# EAGLE design InkTime (EAGLE 9.7.0)
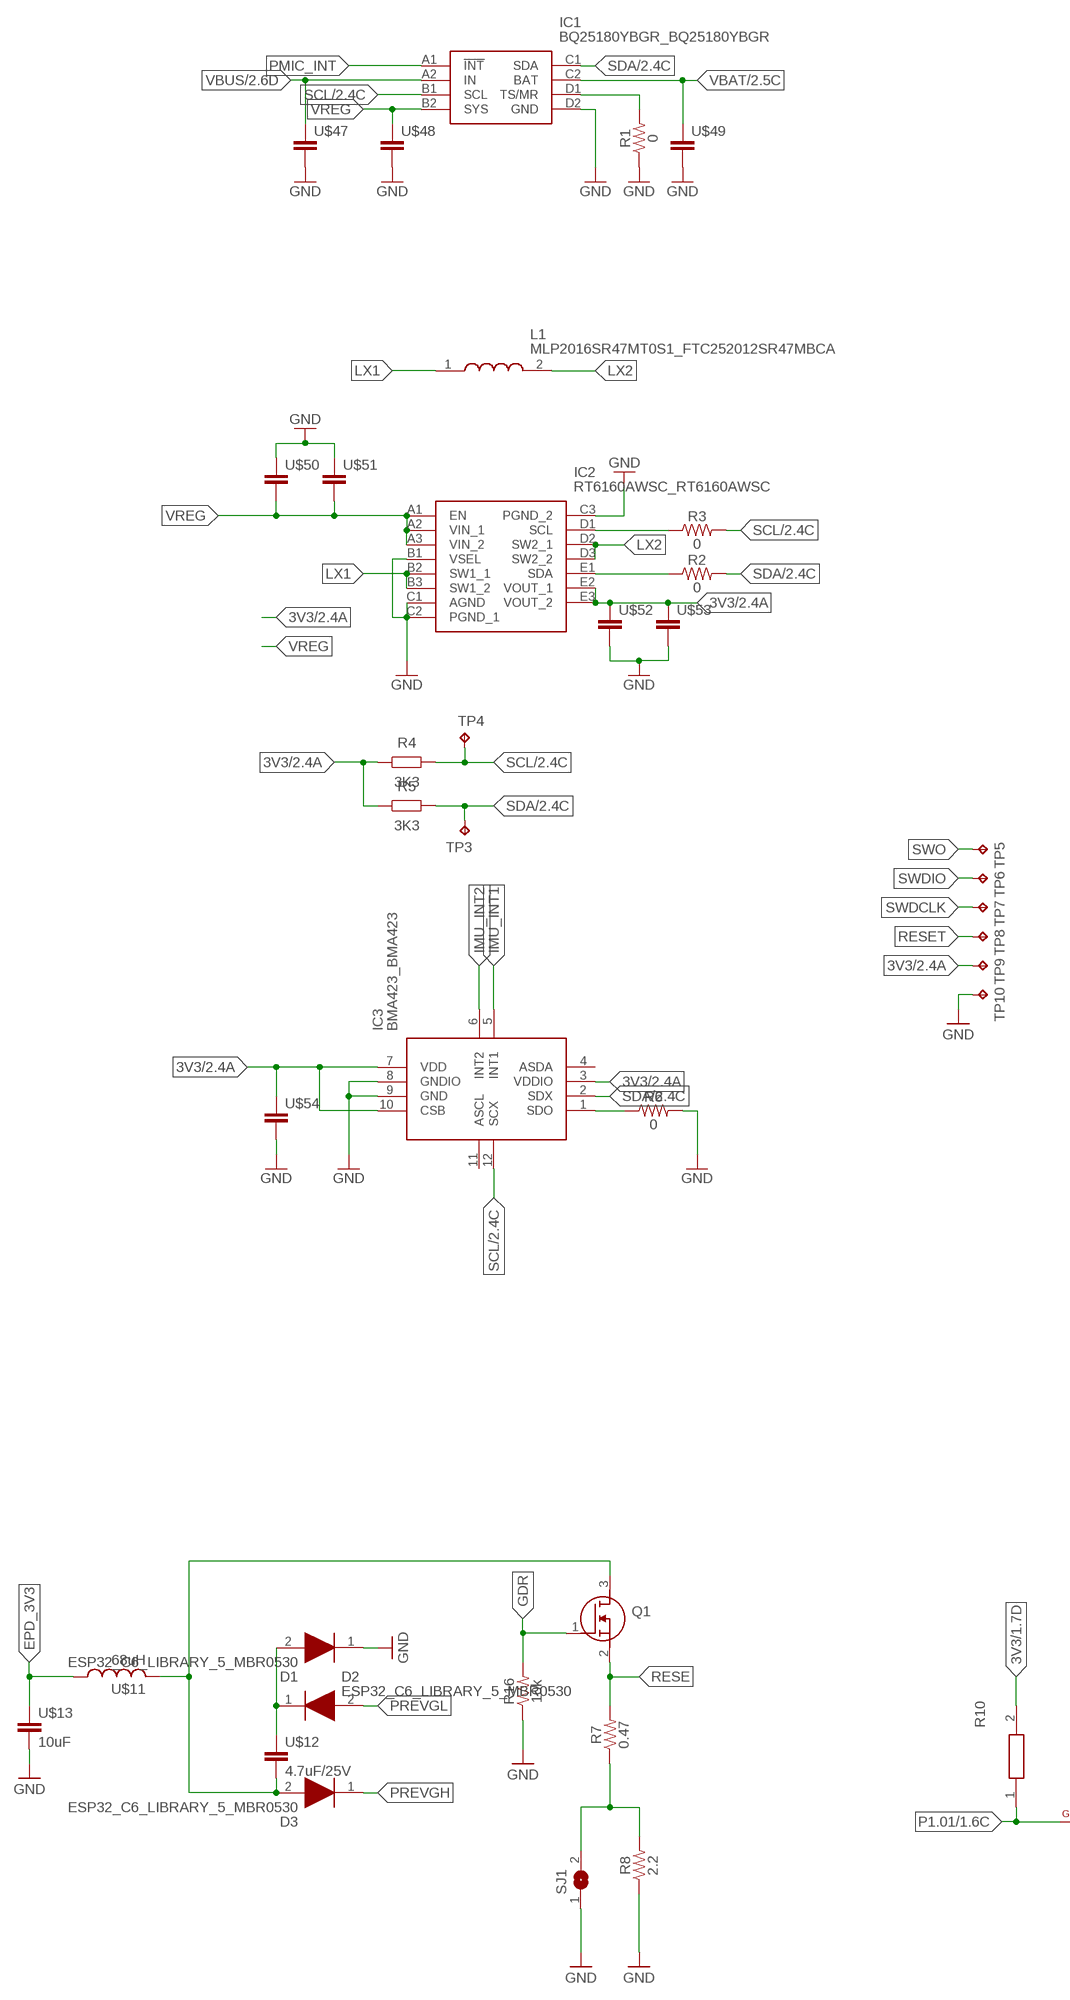
[diagram p0: schematic, sheet 1, part 1 of 3]
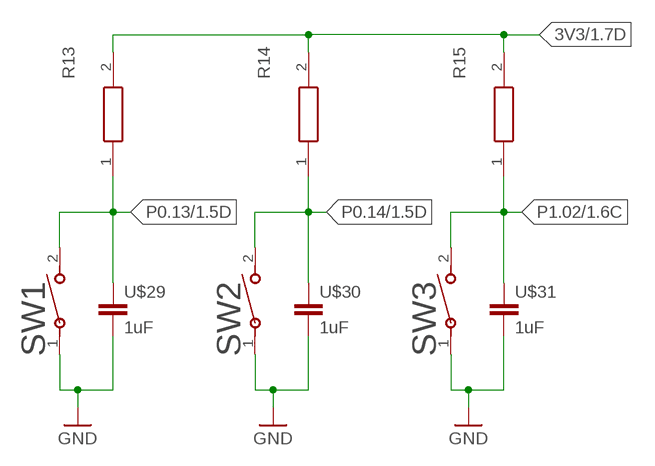
[diagram p1: schematic, sheet 1, part 2 of 3]
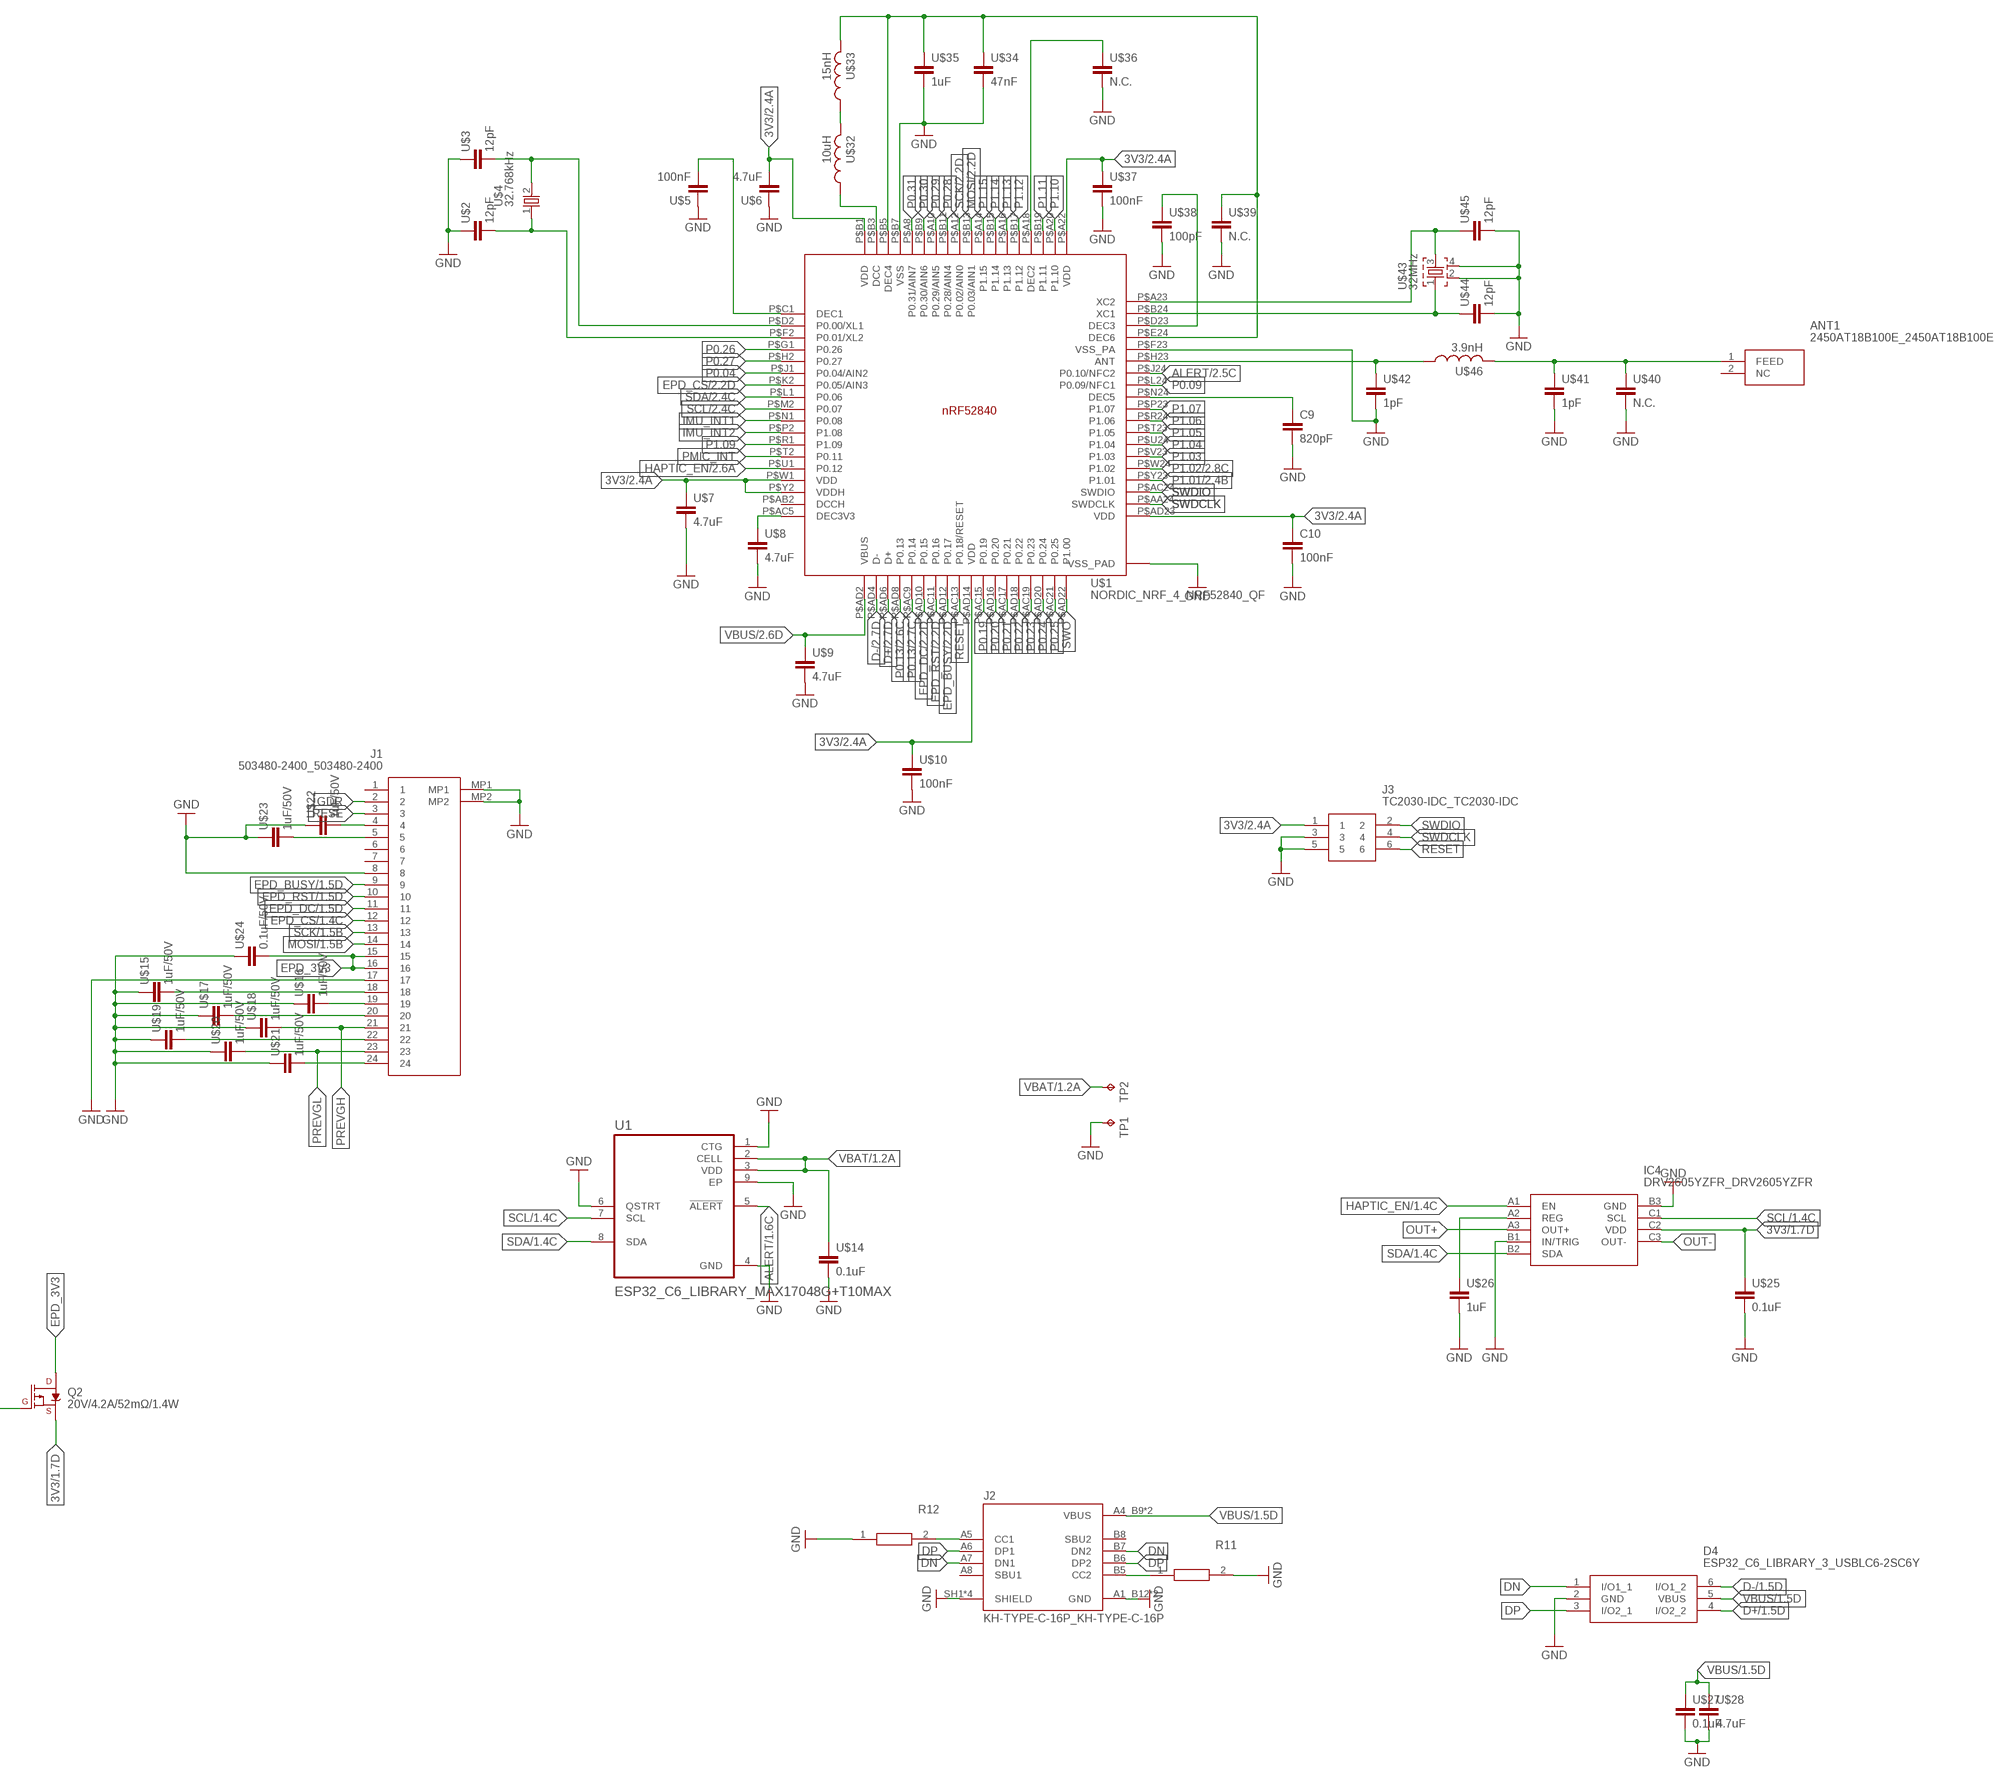
[diagram p2: schematic, sheet 1, part 3 of 3]

## Parts
ANT1  2450AT18B100E_2450AT18B100E  [2450AT18B100E_ANTC3216X140N]
C9  820pF  PERFECT_0402_CAP_0402  [PERFECT_0402_0402]
C10  100nF  PERFECT_0402_CAP_0402  [PERFECT_0402_0402]
D1  ESP32_C6_LIBRARY_5_MBR0530  [ESP32_C6_LIBRARY_5_SOD3716X135N]
D2  ESP32_C6_LIBRARY_5_MBR0530  [ESP32_C6_LIBRARY_5_SOD3716X135N]
D3  ESP32_C6_LIBRARY_5_MBR0530  [ESP32_C6_LIBRARY_5_SOD3716X135N]
D4  ESP32_C6_LIBRARY_3_USBLC6-2SC6Y  [ESP32_C6_LIBRARY_3_SOT95P280X145-6N]
IC1  BQ25180YBGR_BQ25180YBGR  [BQ25180YBGR_BGA8C40P2X4_100X155X50]
IC2  RT6160AWSC_RT6160AWSC  [RT6160AWSC_BGA15C40P3X5_140X230X60]
IC3  BMA423_BMA423  [BMA423_BMA423]
IC4  DRV2605YZFR_DRV2605YZFR  [DRV2605YZFR_BGA9C50P3X3_144X144X62]
J1  503480-2400_503480-2400  [503480-2400_5034802400]
J2  KH-TYPE-C-16P_KH-TYPE-C-16P  [KH-TYPE-C-16P_KINGHELM_KH-TYPE-C-16P]
J3  TC2030-IDC_TC2030-IDC  [TC2030-IDC_TC2030IDC]
L1  MLP2016SR47MT0S1_FTC252012SR47MBCA  [MLP2016SR47MT0S1_INDC2016X100N]
Q1  ESP32_C6_LIBRARY_6_SI1308EDL-T1-GE3  [ESP32_C6_LIBRARY_6_SOT65P210X110-3N]
Q2  20V/4.2A/52mΩ/1.4W  ESP32_C6_LIBRARY_4_ESP32_WROVER_SPARKFUN-DISCRETESEMI_MOSFET_PCH-DMG2305UX-7  [ESP32_C6_LIBRARY_4_ESP32_C6_LIBRARY_4_ESP32_C6_LIBRARY_4_ESP32_C6_LIBRARY_4_ESP32_WROVER_SPARKFUN-DISCRETESEMI_SOT23-3]
R1  0  0OHM-0603-1/10W  [0603]
R2  0  0OHM-0603-1/10W  [0603]
R3  0  0OHM-0603-1/10W  [0603]
R4  3K3  R_CHIP-0402(1005-METRIC)  [RESC1005X40]
R5  3K3  R_CHIP-0402(1005-METRIC)  [RESC1005X40]
R6  0  0OHM-0603-1/10W  [0603]
R7  0.47  0OHM-0603-1/10W  [0603]
R8  2.2  0OHM-0603-1/10W  [0603]
R10  CPF0201D7K68C1_CPF0201D7K68C1  [CPF0201D7K68C1_0201]
R11  CPF0201D7K68C1_CPF0201D7K68C1  [CPF0201D7K68C1_0201]
R12  5k1  CPF0201D7K68C1_CPF0201D7K68C1  [CPF0201D7K68C1_0201]
R13  CPF0201D7K68C1_CPF0201D7K68C1  [CPF0201D7K68C1_0201]
R14  CPF0201D7K68C1_CPF0201D7K68C1  [CPF0201D7K68C1_0201]
R15  CPF0201D7K68C1_CPF0201D7K68C1  [CPF0201D7K68C1_0201]
R16  10k  0OHM-0603-1/10W  [0603]
SJ1  ESP32_C6_LIBRARY_7_JUMPER_SJ  [ESP32_C6_LIBRARY_7_JUMPER_SJ]
SW1  2025-10-22_07-23-44_LIBRARY_EVP-AKE31AEVP-AKE31A  [2025-10-22_07-23-44_LIBRARY_SW_EVP-AKE31A_PAN]
SW2  2025-10-22_07-23-44_LIBRARY_EVP-AKE31AEVP-AKE31A  [2025-10-22_07-23-44_LIBRARY_SW_EVP-AKE31A_PAN]
SW3  2025-10-22_07-23-44_LIBRARY_EVP-AKE31AEVP-AKE31A  [2025-10-22_07-23-44_LIBRARY_SW_EVP-AKE31A_PAN]
TP1  HECTOR_WATCH_1_TPTP20R  [HECTOR_WATCH_1_TP20R]
TP2  HECTOR_WATCH_1_TPTP20R  [HECTOR_WATCH_1_TP20R]
TP3  HECTOR_WATCH_1_TPTP20R  [HECTOR_WATCH_1_TP20R]
TP4  HECTOR_WATCH_1_TPTP20R  [HECTOR_WATCH_1_TP20R]
TP5  HECTOR_WATCH_1_TPTP20R  [HECTOR_WATCH_1_TP20R]
TP6  HECTOR_WATCH_1_TPTP20R  [HECTOR_WATCH_1_TP20R]
TP7  HECTOR_WATCH_1_TPTP20R  [HECTOR_WATCH_1_TP20R]
TP8  HECTOR_WATCH_1_TPTP20R  [HECTOR_WATCH_1_TP20R]
TP9  HECTOR_WATCH_1_TPTP20R  [HECTOR_WATCH_1_TP20R]
TP10  HECTOR_WATCH_1_TPTP20R  [HECTOR_WATCH_1_TP20R]
U1  ESP32_C6_LIBRARY_MAX17048G+T10MAX  [ESP32_C6_LIBRARY_SON50P200X200X80-9N]
U$1  NORDIC_NRF_4_NRF52840_QF  [NORDIC_NRF_4_AQFN50P700X700X85_HS-74N]
U$2  12pF  NORDIC_NRF_3_CAPACITOR_0201_L  [NORDIC_NRF_3_RESC0201_L]
U$3  12pF  NORDIC_NRF_3_CAPACITOR_0201_L  [NORDIC_NRF_3_RESC0201_L]
U$4  32.768kHz  NORDIC_NRF_1_XTAL_32KHZ  [NORDIC_NRF_1_XTAL_3215_N]
U$5  100nF  NORDIC_NRF_3_CAPACITOR_0201_L  [NORDIC_NRF_3_RESC0201_L]
U$6  4.7uF  NORDIC_NRF_3_CAPACITOR_0201_L  [NORDIC_NRF_3_RESC0201_L]
U$7  4.7uF  NORDIC_NRF_3_CAPACITOR_0201_L  [NORDIC_NRF_3_RESC0201_L]
U$8  4.7uF  NORDIC_NRF_3_CAPACITOR_0201_L  [NORDIC_NRF_3_RESC0201_L]
U$9  4.7uF  NORDIC_NRF_3_CAPACITOR_0201_L  [NORDIC_NRF_3_RESC0201_L]
U$10  100nF  NORDIC_NRF_3_CAPACITOR_0201_L  [NORDIC_NRF_3_RESC0201_L]
U$11  68uH  NORDIC_NRF_2_INDUCTOR_0402_L  [NORDIC_NRF_2_RESC0402_L]
U$12  4.7uF/25V  NORDIC_NRF_3_CAPACITOR_0201_L  [NORDIC_NRF_3_RESC0201_L]
U$13  10uF  NORDIC_NRF_3_CAPACITOR_0201_L  [NORDIC_NRF_3_RESC0201_L]
U$14  0.1uF  NORDIC_NRF_3_CAPACITOR_0201_L  [NORDIC_NRF_3_RESC0201_L]
U$15  1uF/50V  NORDIC_NRF_3_CAPACITOR_0201_L  [NORDIC_NRF_3_RESC0201_L]
U$16  1uF/50V  NORDIC_NRF_3_CAPACITOR_0201_L  [NORDIC_NRF_3_RESC0201_L]
U$17  1uF/50V  NORDIC_NRF_3_CAPACITOR_0201_L  [NORDIC_NRF_3_RESC0201_L]
U$18  1uF/50V  NORDIC_NRF_3_CAPACITOR_0201_L  [NORDIC_NRF_3_RESC0201_L]
U$19  1uF/50V  NORDIC_NRF_3_CAPACITOR_0201_L  [NORDIC_NRF_3_RESC0201_L]
U$20  1uF/50V  NORDIC_NRF_3_CAPACITOR_0201_L  [NORDIC_NRF_3_RESC0201_L]
U$21  1uF/50V  NORDIC_NRF_3_CAPACITOR_0201_L  [NORDIC_NRF_3_RESC0201_L]
U$22  1uF/50V  NORDIC_NRF_3_CAPACITOR_0201_L  [NORDIC_NRF_3_RESC0201_L]
U$23  1uF/50V  NORDIC_NRF_3_CAPACITOR_0201_L  [NORDIC_NRF_3_RESC0201_L]
U$24  0.1uF/50V  NORDIC_NRF_3_CAPACITOR_0201_L  [NORDIC_NRF_3_RESC0201_L]
U$25  0.1uF  NORDIC_NRF_3_CAPACITOR_0201_L  [NORDIC_NRF_3_RESC0201_L]
U$26  1uF  NORDIC_NRF_3_CAPACITOR_0201_L  [NORDIC_NRF_3_RESC0201_L]
U$27  0.1uF  NORDIC_NRF_3_CAPACITOR_0201_L  [NORDIC_NRF_3_RESC0201_L]
U$28  4.7uF  NORDIC_NRF_3_CAPACITOR_0201_L  [NORDIC_NRF_3_RESC0201_L]
U$29  1uF  NORDIC_NRF_3_CAPACITOR_0201_L  [NORDIC_NRF_3_RESC0201_L]
U$30  1uF  NORDIC_NRF_3_CAPACITOR_0201_L  [NORDIC_NRF_3_RESC0201_L]
U$31  1uF  NORDIC_NRF_3_CAPACITOR_0201_L  [NORDIC_NRF_3_RESC0201_L]
U$32  10uH  NORDIC_NRF_2_INDUCTOR_0402_L  [NORDIC_NRF_2_RESC0402_L]
U$33  15nH  NORDIC_NRF_2_INDUCTOR_0402_L  [NORDIC_NRF_2_RESC0402_L]
U$34  47nF  NORDIC_NRF_3_CAPACITOR_0201_L  [NORDIC_NRF_3_RESC0201_L]
U$35  1uF  NORDIC_NRF_3_CAPACITOR_0201_L  [NORDIC_NRF_3_RESC0201_L]
U$36  N.C.  NORDIC_NRF_3_CAPACITOR_0201_L  [NORDIC_NRF_3_RESC0201_L]
U$37  100nF  NORDIC_NRF_3_CAPACITOR_0201_L  [NORDIC_NRF_3_RESC0201_L]
U$38  100pF  NORDIC_NRF_3_CAPACITOR_0201_L  [NORDIC_NRF_3_RESC0201_L]
U$39  N.C.  NORDIC_NRF_3_CAPACITOR_0201_L  [NORDIC_NRF_3_RESC0201_L]
U$40  N.C.  NORDIC_NRF_3_CAPACITOR_0201_L  [NORDIC_NRF_3_RESC0201_L]
U$41  1pF  NORDIC_NRF_3_CAPACITOR_0201_L  [NORDIC_NRF_3_RESC0201_L]
U$42  1pF  NORDIC_NRF_3_CAPACITOR_0201_L  [NORDIC_NRF_3_RESC0201_L]
U$43  32MHz  NORDIC_NRF_XTAL_32MHZ  [NORDIC_NRF_BT-XTAL_2016_N]
U$44  12pF  NORDIC_NRF_3_CAPACITOR_0201_L  [NORDIC_NRF_3_RESC0201_L]
U$45  12pF  NORDIC_NRF_3_CAPACITOR_0201_L  [NORDIC_NRF_3_RESC0201_L]
U$46  3.9nH  NORDIC_NRF_2_INDUCTOR_0402_L  [NORDIC_NRF_2_RESC0402_L]
U$47  NORDIC_NRF_3_CAPACITOR_0201_L  [NORDIC_NRF_3_RESC0201_L]
U$48  NORDIC_NRF_3_CAPACITOR_0201_L  [NORDIC_NRF_3_RESC0201_L]
U$49  NORDIC_NRF_3_CAPACITOR_0201_L  [NORDIC_NRF_3_RESC0201_L]
U$50  NORDIC_NRF_3_CAPACITOR_0201_L  [NORDIC_NRF_3_RESC0201_L]
U$51  NORDIC_NRF_3_CAPACITOR_0201_L  [NORDIC_NRF_3_RESC0201_L]
U$52  NORDIC_NRF_3_CAPACITOR_0201_L  [NORDIC_NRF_3_RESC0201_L]
U$53  NORDIC_NRF_3_CAPACITOR_0201_L  [NORDIC_NRF_3_RESC0201_L]
U$54  NORDIC_NRF_3_CAPACITOR_0201_L  [NORDIC_NRF_3_RESC0201_L]

## Nets
3V3/1.7D: IC4.C2(VDD) Q2.2(S) R10.2 R13.2 R14.2 R15.2 U$25.1
3V3/2.4A: C10.1 IC2.E2(VOUT_1) IC2.E3(VOUT_2) IC3.3(VDDIO) IC3.7(VDD) IC3.10(CSB) J3.1 R4.1 R5.1 TP9.TP U$1.P$A22(VDD) U$1.P$AD14(VDD) U$1.P$AD23(VDD) U$1.P$B1(VDD) U$1.P$W1(VDD) U$1.P$Y2(VDDH) U$6.2 U$7.1 U$10.1 U$37.1 U$52.1 U$53.1 U$54.1
ALERT/1.6C: U1.5(!ALERT)
ALERT/2.5C: U$1.P$J24(P0.10/NFC2)
D+/1.5D: D4.4(I/O2_2)
D+/2.7D: U$1.P$AD6(D+)
D-/1.5D: D4.6(I/O1_2)
D-/2.7D: U$1.P$AD4(D-)
DN: D4.1(I/O1_1) J2.A7(DN1) J2.B7(DN2)
DP: D4.3(I/O2_1) J2.A6(DP1) J2.B6(DP2)
EPD_3V3: J1.15 J1.16 Q2.3(D) U$11.1 U$13.1 U$24.2
EPD_BUSY/1.5D: J1.9
EPD_BUSY/2.2D: U$1.P$AD12(P0.17)
EPD_CS/1.4C: J1.12
EPD_CS/2.2D: U$1.P$K2(P0.05/AIN3)
EPD_DC/1.5D: J1.11
EPD_DC/2.2D: U$1.P$AD10(P0.15)
EPD_RST/1.5D: J1.10
EPD_RST/2.2D: U$1.P$AC11(P0.16)
GDR: J1.2 Q1.1(G) R16.2
GND: C9.2 C10.2 D1.1(K) D4.2(GND) IC1.D2(GND) IC2.B1(VSEL) IC2.C1(AGND) IC2.C2(PGND_1) IC2.C3(PGND_2) IC3.8(GNDIO) IC3.9(GND) IC4.B1(IN/TRIG) IC4.B3(GND) J1.8 J1.17 J1.MP1 J1.MP2 J2.A1_B12(GND) J2.A12_B1(GND) J2.SH1(SHIELD) J2.SH2(SHIELD) J2.SH3(SHIELD) J2.SH4(SHIELD) J3.3 J3.5 R1.1 R6.2 R8.1 R11.2 R12.1 R16.1 SJ1.1 SW1.1 SW2.1 SW3.1 TP1.TP TP10.TP U1.1(CTG) U1.4(GND) U1.6(QSTRT) U1.9(EP) U$1.P$74(VSS_PAD) U$1.P$75(VSS_PAD) U$1.P$76(VSS_PAD) U$1.P$77(VSS_PAD) U$1.P$78(VSS_PAD) U$1.P$79(VSS_PAD) U$1.P$80(VSS_PAD) U$1.P$81(VSS_PAD) U$1.P$82(VSS_PAD) U$1.P$83(VSS_PAD) U$1.P$84(VSS_PAD) U$1.P$85(VSS_PAD) U$1.P$86(VSS_PAD) U$1.P$87(VSS_PAD) U$1.P$88(VSS_PAD) U$1.P$89(VSS_PAD) U$1.P$90(VSS_PAD) U$1.P$B7(VSS) U$1.P$F23(VSS_PA) U$2.1 U$3.1 U$5.1 U$6.1 U$7.2 U$8.2 U$9.2 U$10.2 U$13.2 U$14.2 U$15.1 U$16.1 U$17.1 U$18.1 U$19.1 U$20.1 U$21.1 U$22.1 U$23.1 U$24.1 U$25.2 U$26.2 U$27.2 U$28.2 U$29.2 U$30.2 U$31.2 U$34.2 U$35.2 U$36.2 U$37.2 U$38.2 U$39.2 U$40.2 U$41.2 U$42.2 U$43.2 U$43.4 U$44.2 U$45.2 U$47.2 U$48.2 U$49.2 U$50.1 U$51.1 U$52.2 U$53.2 U$54.2
HAPTIC_EN/1.4C: IC4.A1(EN)
HAPTIC_EN/2.6A: U$1.P$U1(P0.12)
IMU_INT1: IC3.5(INT1) U$1.P$N1(P0.08)
IMU_INT2: IC3.6(INT2) U$1.P$P2(P1.08)
LX1: IC2.B2(SW1_1) IC2.B3(SW1_2) L1.1
LX2: IC2.D2(SW2_1) IC2.D3(SW2_2) L1.2
MOSI/1.5B: J1.14
MOSI/2.2D: U$1.P$B13(P0.03/AIN1)
N$1: U$1.P$AC5(DEC3V3) U$8.1
N$2: J2.A5(CC1) R12.2
N$4: D3.2(A) Q1.3(D) U$11.2 U$12.2
N$5: IC2.D1(SCL) R3.1
N$6: IC3.1(SDO) R6.1
N$7: IC1.D1(TS/MR) R1.2
N$8: IC2.E1(SDA) R2.1
N$9: U$1.P$D2(P0.00/XL1) U$3.2 U$4.2
N$10: U$1.P$B5(DEC4) U$1.P$E24(DEC6) U$33.2 U$34.1 U$35.1 U$39.1
N$11: U$1.P$B3(DCC) U$32.1
N$12: D1.2(A) D2.1(K) U$12.1
N$13: U$32.2 U$33.1
N$14: J2.B5(CC2) R11.1
N$15: R7.1 R8.2 SJ1.2
N$16: U$1.P$A18(DEC2) U$36.1
N$17: U$1.P$A23(XC2) U$43.3 U$45.1
N$18: U$1.P$D23(DEC3) U$38.1
N$19: IC4.A2(REG) U$26.1
N$20: U$1.P$C1(DEC1) U$5.2
N$21: U$1.P$F2(P0.01/XL2) U$2.2 U$4.1
N$22: U$1.P$H23(ANT) U$42.1 U$46.1
N$26: J1.18 U$15.2
N$27: J1.19 U$16.2
N$28: J1.20 U$17.2
N$30: J1.22 U$19.2
N$31: U$1.P$B24(XC1) U$43.1 U$44.1
N$32: J1.24 U$21.2
N$33: J1.4 U$22.2
N$34: J1.5 U$23.2
N$35: ANT1.1(FEED) U$40.1 U$41.1 U$46.2
N$38: C9.1 U$1.P$N24(DEC5)
OUT+: IC4.A3(OUT+)
OUT-: IC4.C3(OUT-)
P0.04: U$1.P$J1(P0.04/AIN2)
P0.09: U$1.P$L24(P0.09/NFC1)
P0.13/1.5D: R13.1 SW1.2 U$29.1
P0.13/2.6C: U$1.P$AD8(P0.13)
P0.13/2.7C: U$1.P$AC9(P0.14)
P0.14/1.5D: R14.1 SW2.2 U$30.1
P0.19: U$1.P$AC15(P0.19)
P0.20: U$1.P$AD16(P0.20)
P0.21: U$1.P$AC17(P0.21)
P0.22: U$1.P$AD18(P0.22)
P0.23: U$1.P$AC19(P0.23)
P0.24: U$1.P$AD20(P0.24)
P0.25: U$1.P$AC21(P0.25)
P0.26: U$1.P$G1(P0.26)
P0.27: U$1.P$H2(P0.27)
P0.28: U$1.P$B11(P0.28/AIN4)
P0.29: U$1.P$A10(P0.29/AIN5)
P0.30: U$1.P$B9(P0.30/AIN6)
P0.31: U$1.P$A8(P0.31/AIN7)
P1.01/1.6C: Q2.1(G) R10.1
P1.01/2.4B: U$1.P$Y23(P1.01)
P1.02/1.6C: R15.1 SW3.2 U$31.1
P1.02/2.8C: U$1.P$W24(P1.02)
P1.03: U$1.P$V23(P1.03)
P1.04: U$1.P$U24(P1.04)
P1.05: U$1.P$T23(P1.05)
P1.06: U$1.P$R24(P1.06)
P1.07: U$1.P$P23(P1.07)
P1.09: U$1.P$R1(P1.09)
P1.10: U$1.P$A20(P1.10)
P1.11: U$1.P$B19(P1.11)
P1.12: U$1.P$B17(P1.12)
P1.13: U$1.P$A16(P1.13)
P1.14: U$1.P$B15(P1.14)
P1.15: U$1.P$A14(P1.15)
PMIC_INT: IC1.A1(!INT) U$1.P$T2(P0.11)
PREVGH: D3.1(K) J1.21 U$18.2
PREVGL: D2.2(A) J1.23 U$20.2
RESE: J1.3 Q1.2(S) R7.2
RESET: J3.6 TP8.TP U$1.P$AC13(P0.18/RESET)
SCK/1.5B: J1.13
SCK/2.2D: U$1.P$A12(P0.02/AIN0)
SCL/1.4C: IC4.C1(SCL) U1.7(SCL)
SCL/2.4C: IC1.B1(SCL) IC3.12(SCX) R3.2 R4.2 TP4.TP U$1.P$M2(P0.07)
SDA/1.4C: IC4.B2(SDA) U1.8(SDA)
SDA/2.4C: IC1.C1(SDA) IC3.2(SDX) R2.2 R5.2 TP3.TP U$1.P$L1(P0.06)
SWDCLK: J3.4 TP7.TP U$1.P$AA24(SWDCLK)
SWDIO: J3.2 TP6.TP U$1.P$AC24(SWDIO)
SWO: TP5.TP U$1.P$AD22(P1.00)
VBAT/1.2A: TP2.TP U1.2(CELL) U1.3(VDD) U$14.1
VBAT/2.5C: IC1.C2(BAT) U$49.1
VBUS/1.5D: D4.5(VBUS) J2.A4_B9(VBUS) J2.A9_B4(VBUS) U$27.1 U$28.1
VBUS/2.6D: IC1.A2(IN) U$1.P$AD2(VBUS) U$9.1 U$47.1
VREG: IC1.B2(SYS) IC2.A1(EN) IC2.A2(VIN_1) IC2.A3(VIN_2) U$48.1 U$50.2 U$51.2
Unconnected: ANT1.2(NC) IC3.4(ASDA) IC3.11(ASCL) J1.1 J1.6 J1.7 J2.A8(SBU1) J2.B8(SBU2) U$1.P$AB2(DCCH)

## Library data of the parts
ANT1 = InkTime_v5:2450AT18B100E_2450AT18B100E: Antennas 2.45GHz ANTENNA Source: Datasheet <https://www.johansontechnology.com/datasheets/2450AT18B100/2450AT18B100.pdf>; ARROW_PART_NUMBER: 2450AT18B100E; ARROW_PRICE-STOCK: https://www.arrow.com/en/products/2450at18b100e/johanson-dielectrics?utm_currency=USD&region=nac; DESCRIPTION: Antennas 2.45GHz ANTENNA; HEIGHT: 1.4mm; MANUFACTURER_NAME: JOHANSON TECHNOLOGY; MANUFACTURER_PART_NUMBER: 2450AT18B100E; MOUSER_PART_NUMBER: 609-2450AT18B100E; MOUSER_PRICE-STOCK: https://www.mouser.co.uk/ProductDetail/Johanson-Technology/2450AT18B100E?qs=yCnrNFeXz%252Bh5MFsFIXGZGA%3D%3D
C9 C10 = InkTime_v5:PERFECT_0402_CAP_0402: 0402 (1005 Metric) Nick Garner - TeleSense
D1-D3 = InkTime_v5:ESP32_C6_LIBRARY_5_MBR0530: ON SEMICONDUCTOR - MBR0530 - DIODE, SCHOTTKY, 0.5A, 30V, SOD-123 Source: Datasheet <http://www.onsemi.com/pub/Collateral/MBR0530T1-D.PDF> Check availability <https://pricing.snapeda.com/parts/MBR0530/ON%20Semiconductor/view-part?ref=eda>; AVAILABILITY: In Stock; CHECK_PRICES: https://www.snapeda.com/parts/MBR0530/Onsemi/view-part/?ref=eda; DESCRIPTION: Diode Schottky 30 V 500mA Surface Mount SOD-123; MF: ON Semiconductor; MP: MBR0530; PACKAGE: SOD-123-2 ON Semiconductor; PRICE: None; PURCHASE-URL: https://www.snapeda.com/api/url_track_click_mouser/?unipart_id=179458&manufacturer=ON Semiconductor&part_name=MBR0530&search_term=None; SNAPEDA_LINK: https://www.snapeda.com/parts/MBR0530/Onsemi/view-part/?ref=snap
D4 = InkTime_v5:ESP32_C6_LIBRARY_3_USBLC6-2SC6Y: Low Cap. ESD Protection Auto SOT-23-6 STMicroelectronics USBLC6-2SC6Y, Dual Uni-Directional TVS Diode Array, 6-Pin SOT-23 Source: Datasheet <https://componentsearchengine.com/Datasheets/1/USBLC6-2SC6Y.pdf> Check availability <https://pricing.snapeda.com/parts/USBLC6-2SC6Y/STMicroelectronics/view-part?ref=eda>; AVAILABILITY: In Stock; CHECK_PRICES: https://www.snapeda.com/parts/USBLC6-2SC6Y/STMicroelectronics/view-part/?ref=eda; DESCRIPTION: 17V Clamp 5A (8/20µs) Ipp Tvs Diode Surface Mount SOT-23-6; MF: STMicroelectronics; MP: USBLC6-2SC6Y; PACKAGE: SOT-23-6 STMicroelectronics; PRICE: None; SNAPEDA_LINK: https://www.snapeda.com/parts/USBLC6-2SC6Y/STMicroelectronics/view-part/?ref=snap
IC1 = InkTime_v5:BQ25180YBGR_BQ25180YBGR: Charger IC Lithium Ion/Polymer, Lithium Iron Phosphate 8-DSBGA (1.6x1.1) Source: Datasheet <https://www.ti.com/lit/ds/symlink/bq25180.pdf?ts=1650264094470&ref_url=https%3A%2F%2Fwww.ti.com%2Fproduct%2FBQ25180>; ARROW_PART_NUMBER: BQ25180YBGR; ARROW_PRICE-STOCK: https://www.arrow.com/en/products/bq25180ybgr/texas-instruments?utm_currency=USD&region=nac; DESCRIPTION: Charger IC Lithium Ion/Polymer, Lithium Iron Phosphate 8-DSBGA (1.6x1.1); HEIGHT: 0.5mm; MANUFACTURER_NAME: Texas Instruments; MANUFACTURER_PART_NUMBER: BQ25180YBGR; MOUSER_PART_NUMBER: 595-BQ25180YBGR; MOUSER_PRICE-STOCK: https://www.mouser.co.uk/ProductDetail/Texas-Instruments/BQ25180YBGR?qs=doiCPypUmgEWjAK%252BJAX6Tw%3D%3D
IC2 = InkTime_v5:RT6160AWSC_RT6160AWSC: Buck-Boost Regulator Positive Output Step-Up/Step-Down I2C DC-DC Controller IC 15-WL-CSP (BSC) (1.4x2.3) Source: Datasheet <https://www.richtek.com/SaveDownload.aspx?specid=RT6160A>; DESCRIPTION: Buck-Boost Regulator Positive Output Step-Up/Step-Down I2C DC-DC Controller IC 15-WL-CSP (BSC) (1.4x2.3); HEIGHT: 0.6mm; MANUFACTURER_NAME: RICHTEK; MANUFACTURER_PART_NUMBER: RT6160AWSC; MOUSER_PART_NUMBER: 835-RT6160AWSC; MOUSER_PRICE-STOCK: https://www.mouser.co.uk/ProductDetail/Richtek/RT6160AWSC?qs=amGC7iS6iy%2FLd9PSoixZXQ%3D%3D
IC3 = InkTime_v5:BMA423_BMA423: Accelerometers Triaxial low-g 12bit Acceleration Sensor Source: Datasheet <https://www.mouser.com/datasheet/2/783/BST-BMA423-DS000-1509600.pdf>; ARROW_PART_NUMBER: BMA423; ARROW_PRICE-STOCK: https://www.arrow.com/en/products/bma423/bosch; DESCRIPTION: Accelerometers Triaxial low-g 12bit Acceleration Sensor; HEIGHT: 1mm; MANUFACTURER_NAME: BOSCH; MANUFACTURER_PART_NUMBER: BMA423; MOUSER_PART_NUMBER: 262-BMA423; MOUSER_PRICE-STOCK: https://www.mouser.co.uk/ProductDetail/Bosch-Sensortec/BMA423?qs=HXFqYaX1Q2xC%252BSgeGoX3mg%3D%3D
IC4 = InkTime_v5:DRV2605YZFR_DRV2605YZFR: Haptic Driver for ERM/LRA with Built-In Library and Smart Loop Architecture Source: Datasheet <http://www.ti.com/lit/gpn/drv2605>; ARROW_PART_NUMBER: DRV2605YZFR; ARROW_PRICE-STOCK: https://www.arrow.com/en/products/drv2605yzfr/texas-instruments?region=nac; DESCRIPTION: Haptic Driver for ERM/LRA with Built-In Library and Smart Loop Architecture; HEIGHT: 0.625mm; MANUFACTURER_NAME: Texas Instruments; MANUFACTURER_PART_NUMBER: DRV2605YZFR
J1 = InkTime_v5:503480-2400_503480-2400: FFC & FPC Connectors 0.5mm FPC RA SMT Dual Contact 24Ckt Source: Datasheet <https://componentsearchengine.com/Datasheets/1/503480-2400.pdf>; DESCRIPTION: FFC & FPC Connectors 0.5mm FPC RA SMT Dual Contact 24Ckt; HEIGHT: 1.87mm; MANUFACTURER_NAME: Molex; MANUFACTURER_PART_NUMBER: 503480-2400; MOUSER_PART_NUMBER: 538-503480-2400; MOUSER_PRICE-STOCK: https://www.mouser.co.uk/ProductDetail/Molex/503480-2400?qs=OAhjpuo3Vu7efIoxFh9AOw%3D%3D
J2 = InkTime_v5:KH-TYPE-C-16P_KH-TYPE-C-16P: Check availability <https://pricing.snapeda.com/parts/KH-TYPE-C-16P/kinghelm/view-part?ref=eda>; AVAILABILITY: Not in stock; CHECK_PRICES: https://www.snapeda.com/parts/KH-TYPE-C-16P/Kinghelm/view-part/?ref=eda; MF: kinghelm; MP: KH-TYPE-C-16P; PACKAGE: None; PRICE: None; SNAPEDA_LINK: https://www.snapeda.com/parts/KH-TYPE-C-16P/Kinghelm/view-part/?ref=snap
J3 = InkTime_v5:TC2030-IDC_TC2030-IDC: CABLE ADAPTER 6 POS Source: Datasheet <https://datasheet.datasheetarchive.com/originals/distributors/Datasheets_SAMA/62bc384e093448baaaa63dbd0b9d8707.pdf>; DESCRIPTION: CABLE ADAPTER 6 POS; HEIGHT: 19mm; MANUFACTURER_NAME: Tag Connect; MANUFACTURER_PART_NUMBER: TC2030-IDC
L1 = InkTime_v5:MLP2016SR47MT0S1_FTC252012SR47MBCA: SMD / SMT Inductors (Coils), L=0.47?H, L x W x T : Source: Datasheet <https://product.tdk.com/system/files/dam/doc/product/inductor/inductor/smd/catalog/inductor_commercial_power_mlp2016_en.pdf>; DESCRIPTION: SMD / SMT Inductors (Coils), L=0.47?H, L x W x T :; HEIGHT: 1mm; JLCPCB: https://jlcpcb.com/partdetail/6763488-FTC252012SR47MBCA/C5832368; MANUFACTURER_NAME: TDK; MANUFACTURER_PART_NUMBER: FTC252012SR47MBCA
Q1 = InkTime_v5:ESP32_C6_LIBRARY_6_SI1308EDL-T1-GE3: MOSFET N-Ch 30V 1.5A TrenchFET SC70 Vishay Si1308EDL-T1-GE3 N-channel MOSFET Transistor, 1.5 A, 30 V, 3-Pin SC-70 Source: Datasheet <https://componentsearchengine.com/Datasheets/1/SI1308EDL-T1-GE3.pdf> Check availability <https://pricing.snapeda.com/parts/SI1308EDL-T1-GE3/Vishay%20Siliconix/view-part?ref=eda>; AVAILABILITY: In Stock; CHECK_PRICES: https://www.snapeda.com/parts/SI1308EDL-T1-GE3/Vishay+Siliconix/view-part/?ref=eda; DESCRIPTION: Si1308EDL-T1-GE3 N-channel MOSFET Transistor, 1.5 A, 30 V, 3-Pin SC-70 | Siliconix / Vishay SI1308EDL-T1-GE3; MF: Vishay Siliconix; MP: SI1308EDL-T1-GE3; PACKAGE: SOT-323 Vishay Semiconductor; PRICE: None; PURCHASE-URL: https://www.snapeda.com/api/url_track_click_mouser/?unipart_id=274603&manufacturer=Vishay Siliconix&part_name=SI1308EDL-T1-GE3&search_term=None; SNAPEDA_LINK: https://www.snapeda.com/parts/SI1308EDL-T1-GE3/Vishay+Siliconix/view-part/?ref=snap
Q2 = InkTime_v5:ESP32_C6_LIBRARY_4_ESP32_WROVER_SPARKFUN-DISCRETESEMI_MOSFET_PCH: P-channel MOSFETs Voltage controlled devices that allow control of high current outputs. SparkFun Products: SparkFun ESP32 Thing <https://www.sparkfun.com/products/13907> SparkFun ESP8266 Thing <https://www.sparkfun.com/products/13231> SparkFun Pi Servo HAT V2 <https://www.sparkfun.com/products/15316> DMG2305UX-7 (20V/4.2A/SOT23-3); PROD_ID: TRAN-14388
R1-R3 R6 = SparkFun-Resistors:0OHM: 0Ω resistor A resistor is a passive two-terminal electrical component that implements electrical resistance as a circuit element. Resistors act to reduce current flow, and, at the same time, act to lower voltage levels within circuits. - Wikipedia; PROD_ID: RES-08609
R4 R5 = Resistor:R: Resistor Fixed - Generic; CATEGORY: Resistors; DESCRIPTION: Chip Resistor 1.05 X 0.54 X 0.40 mm body 0402(1005-METRIC) Package; PACKAGE_SIZE: 0402; PACKAGE_TYPE: Surface Mount
R7 R8 R16 = SparkFun-Resistors:0OHM: 0Ω resistor A resistor is a passive two-terminal electrical component that implements electrical resistance as a circuit element. Resistors act to reduce current flow, and, at the same time, act to lower voltage levels within circuits. - Wikipedia; PROD_ID: RES-08609; VALUE: 0
R10-R15 = InkTime_v5:CPF0201D7K68C1_CPF0201D7K68C1: 7.68k 0201 Thin Film Surface Mount Fixed Resistor +/-0.5% 0.031W CPF0201D7K68C1 Source: Datasheet <http://www.te.com/commerce/DocumentDelivery/DDEController?Action=showdoc&DocId=Data Sheet1773200-1ApdfEnglishENG_DS_1773200-1_A.pdf4-2176215-6>
SJ1 = InkTime_v5:ESP32_C6_LIBRARY_7_JUMPER_SJ: SMD solder JUMPER
SW1-SW3 = InkTime_v5:2025-10-22_07-23-44_LIBRARY_EVP-AKE31A
TP1-TP10 = InkTime_v5:HECTOR_WATCH_1_TP: Test pad
U1 = InkTime_v5:ESP32_C6_LIBRARY_MAX17048G+T10: Check availability <https://pricing.snapeda.com/parts/MAX17048G%2BT10/Analog%20Devices/view-part?ref=eda>
U$1 = InkTime_v5:NORDIC_NRF_4_NRF52840_QF: nRF52840 Features Advanced Single chip 2.4 GHz multi-protocol SoC 32-bit ARM Cortex-M4F Processor 1.7v to 5.5v operation 1MB flash + 256kB RAM Bluetooth 5 support for long range and high throughput 802.15.4 radio support On-chip NFC PPI –Programmable Peripheral Interconnect Automated power management system with automatic power management of each peripheral Configurable I/O mapping for analog and digital I/O 48 x GPIO 1 x QSPI 4 x Master/Slave SPI 2 x Two-wire interface (I²C) I²S interface 2 x UART 4 x PWM USB 2.0 controller ARM TrustZone CryptoCell-310 Cryptographic and security module AES 128-bit ECB/CCM/AAR hardware accelerator Digital microphone interface (PDM) Quadrature decoder 12-bit ADC Low power comparator On-chip 50Ω balun On-air compatible with nRF52, nRF51 and nRF24 Series Applications Advanced high performance wearables Wearables for secure payments Virtual Reality/Augmented Reality systems Smart Home sensor networks Smart city sensor networks High performance HID controllers Internet of Things (IoT) sensor networks Smart door locks Smart lighting networks Connected white goods
U$2 U$3 U$5-U$10 U$12-U$31 U$34-U$42 U$44 U$45 U$47-U$54 = InkTime_v5:NORDIC_NRF_3_CAPACITOR: Generic chip capacitor
U$4 = InkTime_v5:NORDIC_NRF_1_XTAL_32KHZ
U$11 U$32 U$33 U$46 = InkTime_v5:NORDIC_NRF_2_INDUCTOR: Generic chip inductor
U$43 = InkTime_v5:NORDIC_NRF_XTAL_32MHZ

## Board
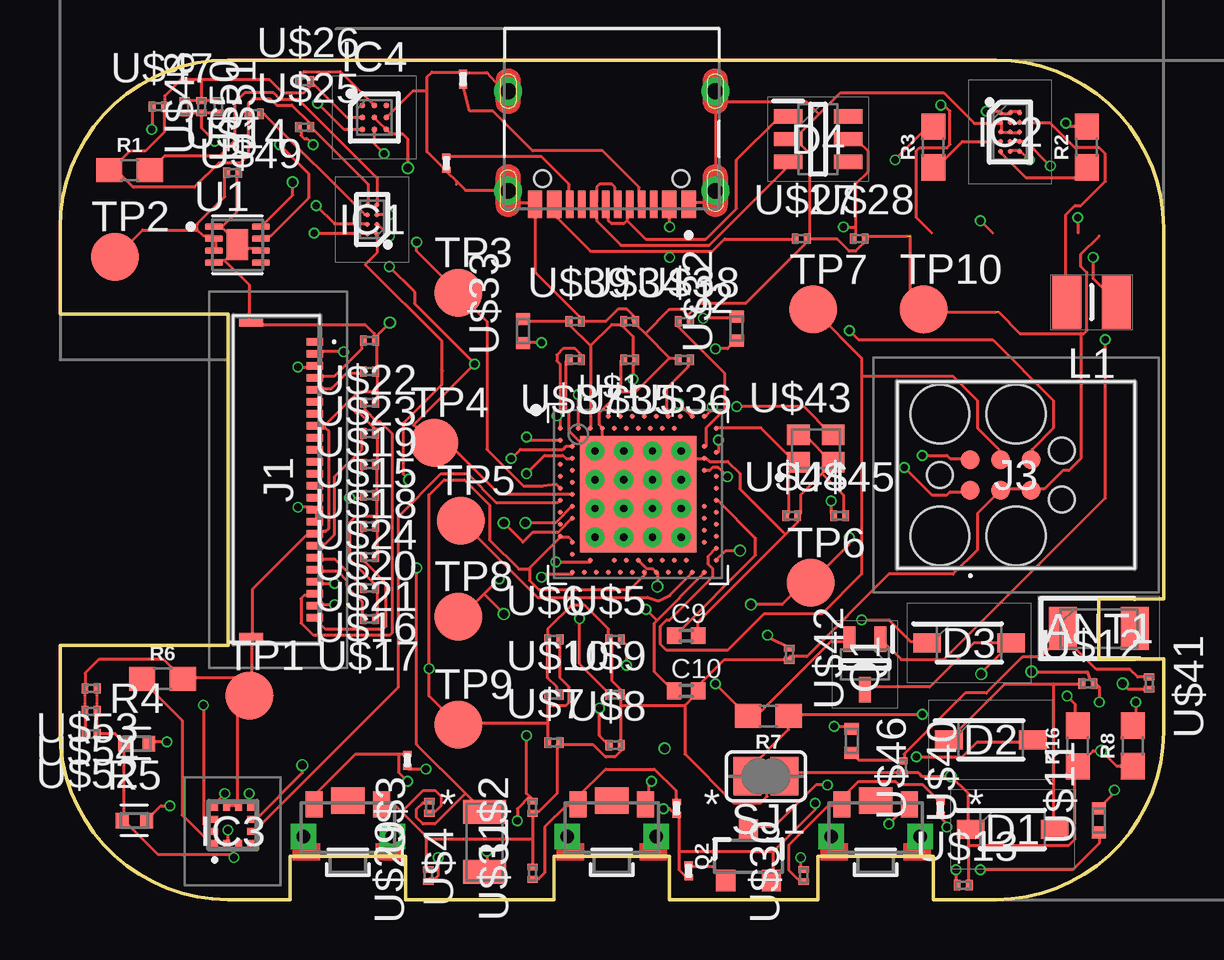
[diagram p3: board, top side]
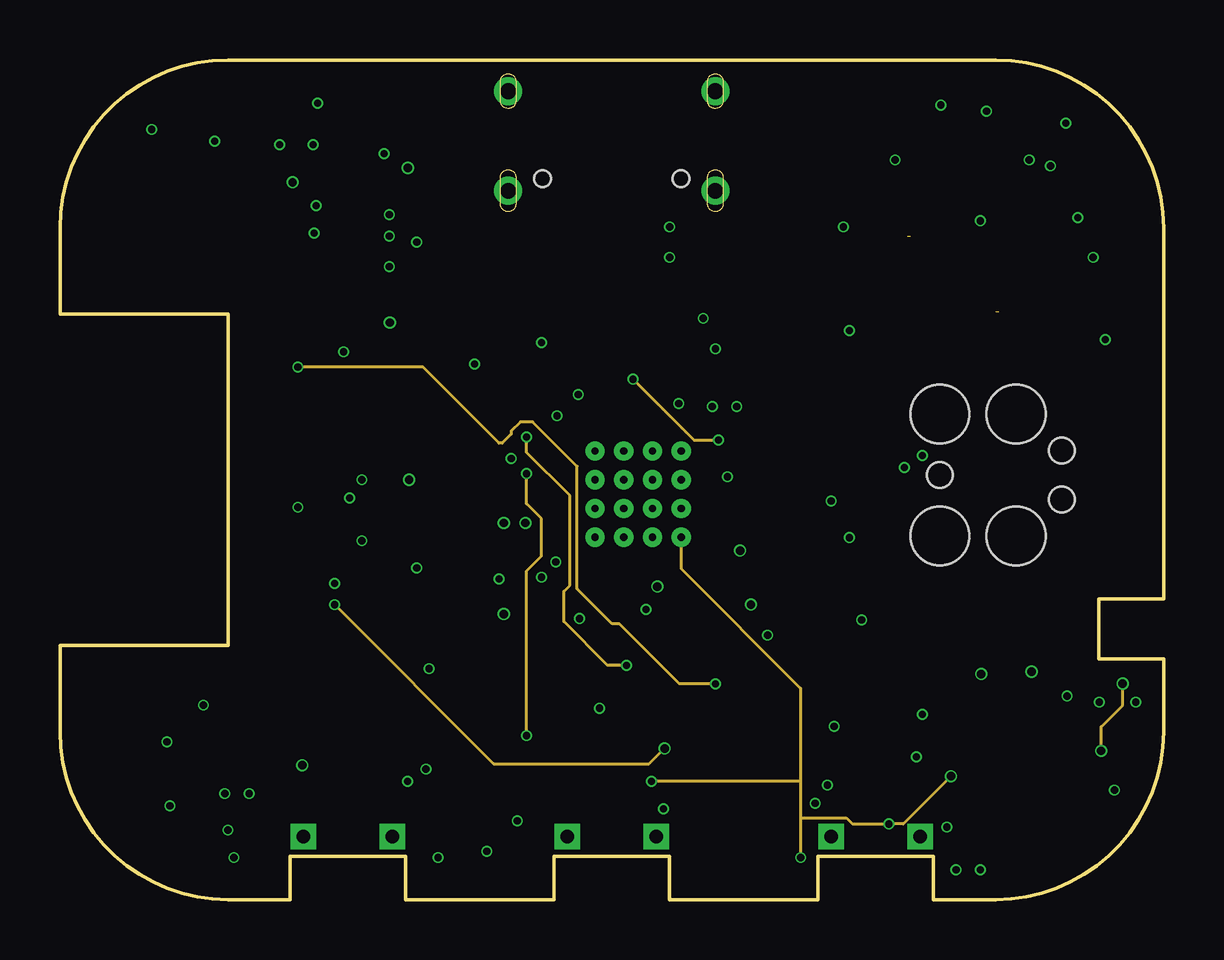
[diagram p4: board, inner layer Route2]
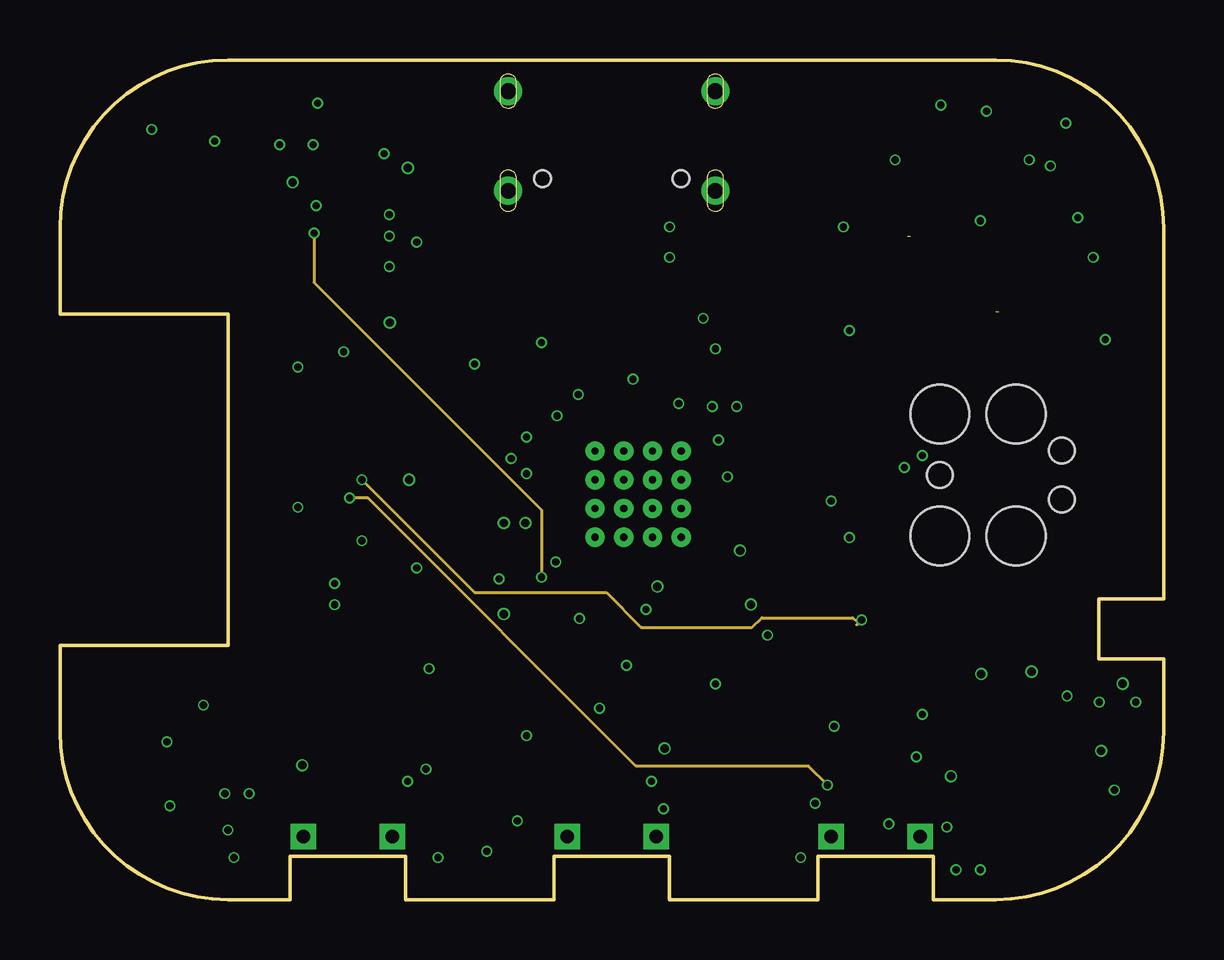
[diagram p5: board, inner layer Route15]
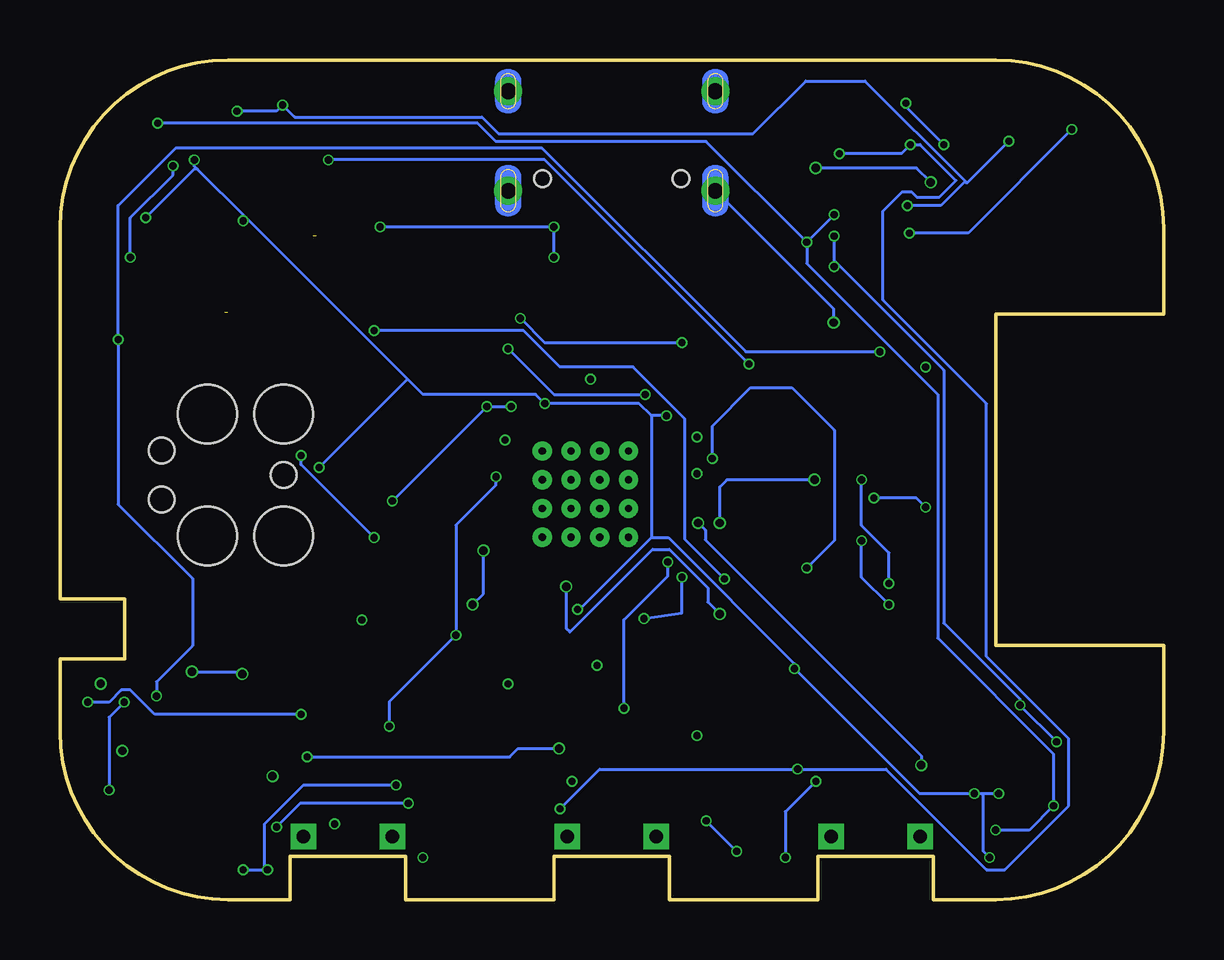
[diagram p6: board, bottom side, seen from below]

Size 46 x 35 mm. Coordinates in mm from the lower left corner, seen from the top.
Outline: 39,0 36.4,0 36.4,1.8 31.6,1.8 31.6,0 25.4,0 25.4,1.8 20.6,1.8 20.6,0 14.4,0 14.4,1.8 9.6,1.8 9.6,0 7,0 arc-90 0,7 0,10.6 7,10.6 7,24.4 0,24.4 0,28 arc-90 7,35 39,35 arc-90 46,28 46,12.54 43.3,12.54 43.3,10.03 46,10.03 46,7 arc-90 39,0
Copper layers (1+2*15+16): Top 0.035mm / dielectric 1.6mm / Route2 0.035mm / dielectric 0.15mm / Route15 0.035mm / dielectric 0.2mm / Bottom 0.035mm
Design rules "jlcpcb-2layers.dru *": minimum track width 5mil, minimum drill 0.2mm, track to track 5mil, track to pad 5mil, pad to pad 5mil, via to via 5mil, smd to smd 5mil, copper to edge 0.2mm, drill to drill 6mil, minimum pad ring 10mil, minimum via ring 3mil, stop-mask expansion 4mil, vias tented up to drill 999mm, thermal gap 10mil

### Footprints (pad centres in the part's own frame; a part is rotated, then mirrored left to right if it is on the bottom)
2450AT18B100E_ANTC3216X140N = smd 1.15 x 1.8: 1 -1.5,0; 2 1.5,0
PERFECT_0402_0402 = smd 0.6 x 0.7: 1 -0.5,0; 2 0.5,0
ESP32_C6_LIBRARY_5_SOD3716X135N = smd 1.15 x 0.8: 1 -1.75,0; 2 1.75,0
ESP32_C6_LIBRARY_3_SOT95P280X145-6N = smd 1.2 x 0.6: 1 -1.25,0.95; 2 -1.25,0; 3 -1.25,-0.95; 4 1.25,-0.95; 5 1.25,0; 6 1.25,0.95
BQ25180YBGR_BGA8C40P2X4_100X155X50 = smd 0.2 x 0.2: A1 -0.2,0.6; A2 0.2,0.6; B1 -0.2,0.2; B2 0.2,0.2; C1 -0.2,-0.2; C2 0.2,-0.2; D1 -0.2,-0.6; D2 0.2,-0.6
RT6160AWSC_BGA15C40P3X5_140X230X60 = smd 0.216 x 0.216: A1 -0.4,0.8; A2 0,0.8; A3 0.4,0.8; B1 -0.4,0.4; B2 0,0.4; B3 0.4,0.4; C1 -0.4,0; C2 0,0; C3 0.4,0; D1 -0.4,-0.4; D2 0,-0.4; D3 0.4,-0.4; E1 -0.4,-0.8; E2 0,-0.8; E3 0.4,-0.8
BMA423_BMA423 = smd 0.3 x 0.35: 1 -0.75,-0.775; 2 -0.25,-0.775; 3 0.25,-0.775; 4 0.75,-0.775; 7 0.75,0.775; 8 0.25,0.775; 9 -0.25,0.775; 10 -0.75,0.775 | smd 0.35 x 0.3: 5 0.775,-0.25; 6 0.775,0.25; 11 -0.775,0.25; 12 -0.775,-0.25
DRV2605YZFR_BGA9C50P3X3_144X144X62 = smd 0.25 x 0.25: A1 -0.5,0.5; A2 0,0.5; A3 0.5,0.5; B1 -0.5,0; B2 0,0; B3 0.5,0; C1 -0.5,-0.5; C2 0,-0.5; C3 0.5,-0.5
503480-2400_5034802400 = smd 0.3 x 0.7: 1 -5.75,1.525; 2 -5.25,1.525; 3 -4.75,1.525; 4 -4.25,1.525; 5 -3.75,1.525; 6 -3.25,1.525; 7 -2.75,1.525; 8 -2.25,1.525; 9 -1.75,1.525; 10 -1.25,1.525; 11 -0.75,1.525; 12 -0.25,1.525; 13 0.25,1.525; 14 0.75,1.525; 15 1.25,1.525; 16 1.75,1.525; 17 2.25,1.525; 18 2.75,1.525; 19 3.25,1.525; 20 3.75,1.525; 21 4.25,1.525; 22 4.75,1.525; 23 5.25,1.525; 24 5.75,1.525 | smd 0.3 x 1: MP1 -6.54,-1.125; MP2 6.54,-1.125
KH-TYPE-C-16P_KINGHELM_KH-TYPE-C-16P = smd 0.6 x 1.15: A1_B12 -3.2,4.725; A4_B9 -2.4,4.725; A9_B4 2.4,4.725; A12_B1 3.2,4.725 | smd 0.3 x 1.15: A5 -1.25,4.725; A6 -0.25,4.725; A7 0.25,4.725; A8 1.25,4.725; B5 1.75,4.725; B6 0.75,4.725; B7 -0.75,4.725; B8 -1.75,4.725 | drill 0.65 pad 1.05: SH1 -4.32,0; SH2 4.32,0; SH3 -4.32,4.15; SH4 4.32,4.15 | hole 0.7: -2.89,3.65; 2.89,3.65
TC2030-IDC_TC2030IDC = smd 0.783 x 0.783: 1 -0.953,-0.635; 2 -0.953,0.635; 3 0.317,-0.635; 4 0.317,0.635; 5 1.588,-0.635; 6 1.588,0.635 | hole 2.451: -2.223,-2.54; -2.223,2.54; 0.952,-2.54; 0.952,2.54 | hole 1.067: -2.223,0; 2.857,-1.016; 2.857,1.016
MLP2016SR47MT0S1_INDC2016X100N = smd 1.2 x 2.2: 1 -1.028,0; 2 1.028,0
ESP32_C6_LIBRARY_6_SOT65P210X110-3N = smd 1.05 x 0.5: 1 -1.05,0.65; 2 -1.05,-0.65; 3 1.05,0
ESP32_C6_LIBRARY_4_ESP32_C6_LIBRARY_4_ESP32_C6_LIBRARY_4_ESP32_C6_LIBRARY_4_ESP32_WROVER_SPARKFUN-DISCRETESEMI_SOT23-3 = smd 0.8 x 0.9: 1 -0.95,-1; 2 0.95,-1; 3 0,1.1
0603 = smd 1.1 x 1: 1 -0.85,0; 2 0.85,0
RESC1005X40 = smd 0.535 x 0.644: 1 -0.507,0; 2 0.507,0
CPF0201D7K68C1_0201 = smd 0.35 x 0.25: 1 0,0.275; 2 0,-0.275
ESP32_C6_LIBRARY_7_JUMPER_SJ = smd 1.168 x 1.6: 1 -0.762,0; 2 0.762,0
2025-10-22_07-23-44_LIBRARY_SW_EVP-AKE31A_PAN = smd 0.711 x 1.092: 1 -1.4,-0.972; 2 1.4,-0.972 | drill 0.559 pad 0.914 square: 3 -1.848,0.381; 4 1.848,0.381 | smd 1.397 x 1.092: 5 0,-1.124
HECTOR_WATCH_1_TP20R = smd 2 x 2: TP 0,0
ESP32_C6_LIBRARY_SON50P200X200X80-9N = smd 0.76 x 0.27: 1 -0.985,0.75; 2 -0.985,0.25; 3 -0.985,-0.25; 4 -0.985,-0.75; 5 0.985,-0.75; 6 0.985,-0.25; 7 0.985,0.25; 8 0.985,0.75 | smd 0.9 x 1.3: 9 0,0
NORDIC_NRF_4_AQFN50P700X700X85_HS-74N = smd 4.85 x 4.85: P$74 0,0 | drill 0.3 pad 0.6: P$75 -1.8,1.8; P$76 -0.6,1.8; P$77 0.6,1.8; P$78 1.8,1.8; P$79 -1.8,0.6; P$80 -0.6,0.6; P$81 0.6,0.6; P$82 1.8,0.6; P$83 -1.8,-0.6; P$84 -0.6,-0.6; P$85 0.6,-0.6; P$86 1.8,-0.6; P$87 -1.8,-1.8; P$88 -0.6,-1.8; P$89 0.6,-1.8; P$90 1.8,-1.8 | smd 0.2 x 0.2: P$A8 -1.25,3.25; P$A10 -0.75,3.25; P$A12 -0.25,3.25; P$A14 0.25,3.25; P$A16 0.75,3.25; P$A18 1.25,3.25; P$A20 1.75,3.25; P$A22 2.25,3.25; P$A23 2.75,3.25; P$AA24 3.25,-2.25; P$AB2 -2.75,-2.5; P$AC5 -2,-2.75; P$AC9 -1,-2.75; P$AC11 -0.5,-2.75; P$AC13 0,-2.75; P$AC15 0.5,-2.75; P$AC17 1,-2.75; P$AC19 1.5,-2.75; P$AC21 2,-2.75; P$AC24 3.25,-2.75; P$AD2 -2.75,-3.25; P$AD4 -2.25,-3.25; P$AD6 -1.75,-3.25; P$AD8 -1.25,-3.25; P$AD10 -0.75,-3.25; P$AD12 -0.25,-3.25; P$AD14 0.25,-3.25; P$AD16 0.75,-3.25; P$AD18 1.25,-3.25; P$AD20 1.75,-3.25; P$AD22 2.25,-3.25; P$AD23 2.75,-3.25; P$B1 -3.25,2.75; P$B3 -2.5,2.75; P$B5 -2,2.75; P$B7 -1.5,2.75; P$B9 -1,2.75; P$B11 -0.5,2.75; P$B13 0,2.75; P$B15 0.5,2.75; P$B17 1,2.75; P$B19 1.5,2.75; P$B24 3.25,2.75; P$C1 -3.25,2.25; P$D2 -2.75,2; P$D23 2.75,2; P$E24 3.25,1.75; P$F2 -2.75,1.5; P$F23 2.75,1.5; P$G1 -3.25,1.25; P$H2 -2.75,1; P$H23 2.75,1; P$J1 -3.25,0.75; P$J24 3.25,0.75; P$K2 -2.75,0.5; P$L1 -3.25,0.25; P$L24 3.25,0.25; P$M2 -2.75,0; P$N1 -3.25,-0.25; P$N24 3.25,-0.25; P$P2 -2.75,-0.5; P$P23 2.75,-0.5; P$R1 -3.25,-0.75; P$R24 3.25,-0.75; P$T2 -2.75,-1; P$T23 2.75,-1; P$U1 -3.25,-1.25; P$U24 3.25,-1.25; P$V23 2.75,-1.5; P$W1 -3.25,-1.75; P$W24 3.25,-1.75; P$Y2 -2.75,-2; P$Y23 2.75,-2
NORDIC_NRF_3_RESC0201_L = smd 0.28 x 0.43: 1 -0.255,0; 2 0.255,0
NORDIC_NRF_1_XTAL_3215_N = smd 1 x 1.8: 1 -1.25,0; 2 1.25,0
NORDIC_NRF_2_RESC0402_L = smd 0.5 x 0.6: 1 -0.5,0; 2 0.5,0
NORDIC_NRF_BT-XTAL_2016_N = smd 0.95 x 0.85: 1 -0.725,-0.575; 2 0.725,-0.575; 3 0.725,0.575; 4 -0.725,0.575

### Placement (x,y rotation side)
ANT1  43.3,11.3 0 top
C9  26.1,11 0 top
C10  26.1,8.7 0 top
D1  39.7,2.92 0 top
D2  38.8,6.66 0 top
D3  37.9,10.7 0 top
D4  31.6,31.7 0 top
IC1  13.01,28.35 180 top
IC2  39.6,32 0 top
IC3  7.2,3.1 0 top
IC4  13.1,32.6 0 top
J1  9.1,17.5 270 top
J2  23,33.7 180 top
J3  38.9,17.7 0 top
L1  43,24.9 0 top
Q1  33.55,9.8 270 top
Q2  28.7,1.8 0 top
R1  2.9,30.4 0 top
R2  42.8,31.37 90 top
R3  36.4,31.37 90 top
R4  3.2,6.5 0 top
R5  3.1,3.3 0 top
R6  4.28,9.2 0 top
R7  29.53,7.66 180 top
R8  44.73,6.4 90 top
R10  26.2,1.2 0 top
R11  16.1,30.7 0 top
R12  16.8,34.2 0 top
R13  14.48,5.8 0 top
R14  36.7,3.8 0 top
R15  25.7,3.8 0 top
R16  42.43,6.4 90 top
SJ1  29.43,5.14 180 top
SW1  12,3 180 top
SW2  34,3 180 top
SW3  23,3 180 top
TP1  7.9,8.5 0 top
TP2  2.3,26.8 0 top
TP3  16.6,25.3 0 top
TP4  15.6,19.05 0 top
TP5  16.7,15.8 0 top
TP6  31.3,13.2 0 top
TP7  31.4,24.6 0 top
TP8  16.6,11.8 0 top
TP9  16.6,7.3 0 top
TP10  36,24.6 0 top
U1  7.39,27.3 0 top
U$1  24.1,16.9 0 top
U$2  19.7,3.85 90 top
U$3  15.4,3.85 90 top
U$4  17.7,2.4 90 top
U$5  23.14,10.84 0 top
U$6  20.59,10.84 0 top
U$7  20.59,6.54 0 top
U$8  23.14,6.44 0 top
U$9  23.14,8.54 0 top
U$10  20.59,8.54 0 top
U$11  43.3,3.3 90 top
U$12  42.85,9 0 top
U$13  37.65,0.6 0 top
U$14  7.2,30.3 0 top
U$15  12.9,19.43 180 top
U$16  12.9,12.99 180 top
U$17  12.9,11.7 180 top
U$18  12.9,18.14 180 top
U$19  12.9,20.72 180 top
U$20  12.9,15.57 180 top
U$21  12.9,14.28 180 top
U$22  12.9,23.3 180 top
U$23  12.9,22.01 180 top
U$24  12.9,16.86 180 top
U$25  10.19,32.2 0 top
U$26  10.19,34.1 0 top
U$27  30.9,27.55 0 top
U$28  33.31,27.55 0 top
U$29  15.35,1 90 top
U$30  31,1 90 top
U$31  19.7,1.1 90 top
U$32  28.2,23.8 90 top
U$33  19.3,23.7 90 top
U$34  23.75,24.1 0 top
U$35  23.75,22.5 180 top
U$36  26.02,22.5 180 top
U$37  21.48,22.5 180 top
U$38  26.02,24.1 0 top
U$39  21.48,24.1 0 top
U$40  35.1,5.53 270 top
U$41  45.4,9.03 270 top
U$42  30.4,10.22 270 top
U$43  31.5,18.8 0 top
U$44  30.5,16 0 top
U$45  32.5,16 0 top
U$46  33,6.62 270 top
U$47  4.1,33.05 0 top
U$48  6.6,33.05 90 top
U$49  8.1,32.75 180 top
U$50  5.2,33.05 270 top
U$51  5.9,33.05 270 top
U$52  1.3,6.9 180 top
U$53  1.3,8.8 180 top
U$54  1.3,7.85 180 top

### Tracks (layer width: path | path; a pad name or v marks a point on that pad's centre or on a via)
3V3/1.7D  (via drill 0.3)
  Top 0.127: v36.97,3.02 36.97,3.15 36.72,3.4 R14.2 | v31.48,4.01 31.48,3.76 29.73,2.01 | 29.73,2.01 29.73,0.86 Q2.2 | v10.55,31.47 10.3,31.72 10.17,31.72 10.05,31.85 10.05,32.11 U$25.1 | v15.25,5.44 14.49,5.44 R13.2 | v25.16,3.78 25.41,3.78 25.67,3.53 R15.2 25.79,3.4 25.79,2.01 | 25.79,2.01 25.79,1.24 26.05,0.99 26.18,0.99 R10.2 | 25.79,2.01 29.73,2.01 | IC4.C2 13.1,31.51 v13.51,31.1
  Bottom 0.127: v36.97,3.02 35.98,4.01 v31.48,4.01 | v25.16,3.78 23.51,5.44 v15.25,5.44 11.57,5.44 7.38,1.24 6.62,1.24 3.95,3.91 3.95,6.71 7.38,10.13 7.38,20.68 11.7,24.99 11.7,28.7 10.9,29.5 10.5,29.5 10.26,29.26 9.36,29.26 8.65,29.97 10.15,31.47 v10.55,31.47 10.93,31.1 v13.51,31.1
3V3/2.4A  (via drill 0.3)
  Top 0.127: 20.84,15.09 21.22,15.09 21.35,14.96 U$1.P$Y2 | 19.57,13.82 19.57,13.31 19.95,12.93 23.76,12.93 24.4,13.56 U$1.P$AD14 | 20.84,15.09 19.57,13.82 | 19.57,13.82 19.53,13.77 19.13,13.77 17.9,15 17.9,16.46 16.86,17.5 16.02,17.5 15.38,16.86 v15.38,9.63 15.38,8.48 16.52,7.34 TP9.TP 16.65,7.34 20.33,7.34 | 20.84,15.09 U$1.P$W1 | 20.33,8.1 20.33,8.48 U$10.1 | 20.33,8.1 20.33,7.34 | 20.33,7.34 20.33,6.58 U$7.1 | 20.33,8.1 21.09,8.1 21.22,8.23 21.22,8.86 20.84,9.24 20.84,10.77 U$6.2 | 2.68,6.58 R4.1 | v6.87,4.42 6.49,4.04 6.49,3.91 IC3.10 | v7.89,4.42 7.89,3.91 IC3.7 | 7.12,1.88 7.38,2.13 7.38,2.26 IC3.3 | 7.12,1.88 4.08,1.88 2.68,3.28 R5.1 2.68,3.4 2.68,6.45 R4.1 | 7.12,1.88 v7.25,1.75 | 24.89,11.64 24.78,11.53 24.78,9.5 25.54,8.74 C10.1 | 24.89,11.64 26.81,13.56 U$1.P$AD23 | 40.02,31.22 39.64,31.22 IC2.E2 | 20.84,20.17 20.84,22.33 20.71,22.45 20.71,22.71 20.97,22.96 21.48,22.96 21.73,22.71 U$37.1 | 20.84,20.17 U$1.P$B1 | v25.79,20.68 26.3,20.17 U$1.P$A22 | 20.84,20.17 v20.71,20.17 | v40.4,30.84 40.02,31.22 | 40.02,31.22 IC2.E3 | v38.37,28.3 38.88,27.79 | v42.43,28.42 42.43,27.79 | v35.19,18.01 36.34,16.86 36.97,16.86 37.1,16.99 37.86,16.99 J3.1 | v24.43,12.09 24.89,11.64 | R4.1 2.29,6.9 U$52.1 U$54.1 U$53.1
  Bottom 0.127: 7.51,4.42 v7.89,4.42 10.17,4.42 v15.38,9.63 15.38,9.83 20.64,15.09 21.35,15.09 | 7.51,4.42 v6.87,4.42 | 7.51,4.42 7.51,2.01 v7.25,1.75 | 21.35,20.17 21.86,20.68 v25.79,20.68 26.18,21.06 30.87,21.06 31.51,21.69 | v20.71,20.17 21.35,20.17 | v40.4,30.84 40.4,30.58 40.27,30.45 | 31.51,21.69 38.24,28.42 | 38.24,28.42 40.27,30.45 | 38.24,28.42 v38.37,28.3 | v42.43,28.42 40.4,30.45 40.27,30.45 | 31.51,21.69 v35.19,18.01 | v24.43,12.09 24.34,12.09 21.35,15.09 | 21.35,20.17 21.35,15.09
DN
  Top 0.127: 23.64,28.3 23.51,28.17 23,28.17 22.87,28.3 22.87,28.93 J2.A7 | 23.64,28.3 23.64,28.93 J2.B7 | 23.64,28.3 24.4,27.53 26.94,27.53 28.21,28.8 28.21,30.84 29.98,32.61 30.24,32.61 D4.1
DP
  Top 0.127: J2.A6 23.13,29.06 23.13,29.69 23,29.82 22.49,29.82 22.36,29.69 22.36,29.06 J2.B6 22.36,28.93 22.36,28.3 23.38,27.28 27.06,27.28 30.24,30.45 30.24,30.71 D4.3
EPD_3V3  (via drill 0.3)
  Top 0.127: v12.08,16.74 12.59,16.74 U$24.2 | v9.92,16.36 10.55,16.36 J1.15 10.68,16.23 10.68,15.85 J1.16 | v37.35,1.24 37.35,0.61 U$13.1 | v38.37,1.24 42.22,1.24 43.34,2.37 43.34,2.76 U$11.1 | v31.99,4.77 31.51,4.77 29.76,3.02 28.71,3.02 Q2.3
  Route15 0.127: v12.08,16.74 12.84,16.74 24.02,5.56 31.2,5.56 v31.99,4.77
  Bottom 0.127: v12.08,16.74 10.3,16.74 v9.92,16.36 | v38.37,1.24 37.48,1.24 | v31.99,4.77 35.85,4.77 37.48,3.15 37.48,1.24 | 37.48,1.24 v37.35,1.24
GDR  (via drill 0.3)
  Top 0.127: v11.82,22.83 10.68,22.83 J1.2 | v43.57,23.34 43.57,16.74 36.84,10.01 35.06,10.01 34.3,10.77 Q1.1 | v41.98,8.48 42.3,8.16 42.3,7.29 R16.2
  Bottom 0.127: v11.82,22.83 17.41,22.83 25.92,31.34 41.16,31.34 43.57,28.93 v43.57,23.34 43.57,16.47 40.48,13.38 40.48,10.58 41.98,9.08 v41.98,8.48
GND  (via drill 0.3, 0.35)  (2 unrouted)
  Top 0.127: 42.43,5.64 R16.1 | 44.34,5.56 44.72,5.56 R8.1 44.05,5.55 v43.4,6.2 43.07,6.2 R16.1 | 37.86,2.26 37.86,2.89 D1.1 37.86,3.02 37.86,4.43 v37.14,5.14 35.94,5.14 35.8,5.28 35.11,5.28 U$40.2 35.09,5.28 30.36,5.28 SJ1.1 30.11,5.05 29.48,4.42 29.48,4.29 29.22,4.04 28.08,4.04 26.05,6.07 26.05,8.1 | 37.86,2.26 37.86,0.61 U$13.2 | 37.86,2.26 42.05,2.26 42.3,2.51 42.3,5.52 R16.1 | 15.25,2.51 15.25,2.64 14.24,3.66 | 15.25,2.51 15.25,1.37 U$29.2 | 14.24,3.66 13.98,3.91 13.47,3.91 SW1.1 | 14.24,3.66 15.13,4.55 15.63,4.55 15.89,4.29 15.89,3.91 15.63,3.66 15.51,3.66 U$3.1 | U$10.2 20.71,8.61 20.71,8.86 20.33,9.24 20.33,10.77 U$6.1 20.33,10.9 20.33,11.28 21.33,12.27 21.88,12.27 22.87,11.28 22.87,10.9 U$5.1 23,10.77 23,9.12 23.51,8.61 U$9.2 23.38,8.48 23.38,8.1 | 19.7,2.51 19.7,3.53 U$2.1 19.82,3.66 19.95,3.66 20.71,4.42 20.71,6.45 U$7.2 20.84,6.45 22.24,6.45 22.75,5.94 23.13,5.94 23.51,6.32 U$8.2 23.38,6.45 23.38,8.1 | 19.7,2.51 U$31.2 | 26.05,8.1 26.56,8.61 C10.2 26.68,8.74 26.68,8.99 27.7,10.01 30.33,10.01 U$42.2 30.41,10.13 31.13,10.13 34.56,13.56 37.22,13.56 38.24,14.58 38.24,16.1 39.13,16.99 J3.3 39.26,17.12 40.4,17.12 J3.5 40.53,17.12 41.03,17.12 41.8,17.88 42.05,17.88 42.56,18.39 42.56,23.6 | 23.38,8.1 26.05,8.1 | 19.7,2.51 15.25,2.51 | IC4.B1 12.59,32.61 11.95,32.61 10.55,34.01 U$26.2 10.43,34.01 10.43,33.88 10.17,33.63 9.28,33.63 8.73,34.18 5.95,34.18 | 5.95,34.18 5.04,34.18 4.36,33.5 U$47.2 4.36,32 3.57,31.22 2.93,31.22 2.17,30.45 R1.1 2.17,30.33 2.43,30.33 3.06,29.69 5.6,29.69 6.62,30.71 7.51,30.71 | 7.38,3.91 7,3.91 IC3.9 | 7.38,3.91 7.38,7.97 7.89,8.48 TP1.TP
  Top 0.127: 7.38,3.91 IC3.8 | 8.01,9.24 8.01,8.61 TP1.TP | 8.01,9.24 8.01,10.9 J1.MP2 8.01,11.02 8.01,12.93 10.3,15.21 10.55,15.21 J1.17 10.68,15.34 11.06,15.34 11.19,15.47 11.19,19.53 11.06,19.66 10.94,19.66 | 8.01,9.24 5.22,9.24 R6.2 5.09,9.24 4.33,10.01 1.61,10.01 1.05,9.45 U$53.2 U$54.2 U$52.2 | 8.01,9.24 TP1.TP | U$17.1 13.22,11.79 13.22,12.93 U$16.1 13.09,13.05 13.09,13.18 12.08,14.2 12.08,15.72 12.33,15.98 13.22,15.98 | U$21.1 13.22,14.32 13.22,15.47 U$20.1 13.22,15.6 13.22,15.98 | 13.22,15.98 13.22,16.74 U$24.1 13.22,16.86 13.22,18.14 U$18.1 13.22,18.26 13.22,19.41 U$15.1 13.09,19.53 13.09,19.66 12.46,20.29 12.33,20.29 11.95,20.68 | 13.22,21.18 13.22,21.95 U$23.1 13.22,22.07 13.22,23.21 U$22.1 | 13.22,21.18 13.22,20.8 U$19.1 | 10.94,19.66 10.68,19.66 J1.8 10.94,19.66 | 13.22,21.18 12.46,21.18 11.95,20.68 | 10.94,19.66 11.95,20.68 | IC1.D2 12.84,28.93 12.84,29.82 10.55,32.11 U$25.2 10.43,32.23 10.43,32.36 9.66,33.12 9.03,33.12 8.78,33.38 8.01,33.38 7.85,33.21 U$49.2 7.85,31.05 7.51,30.71 | 7.51,30.71 7.51,30.33 U$14.2 7.38,30.2 7.38,28.68 6.74,28.04 | 6.87,26.64 6.49,26.64 U1.4 | 7.38,27.15 7.51,27.28 U1.9 | 7.38,27.15 6.87,26.64 | 7.38,27.15 8.27,27.15 U1.6 | 7.38,27.15 U1.9 | 6.74,28.04 6.49,28.04 U1.1 6.74,28.04 | 6.74,28.04 7.38,27.41 U1.9 | 6.87,26.64 7.89,25.63 7.89,24.1 J1.MP1 8.01,23.98 12.71,23.98 13.09,23.6 13.09,23.34 U$22.1 | J2.A1_B12 26.3,29.06 26.94,29.06 27.32,29.44 J2.SH3 27.32,29.56 27.32,33.25 | 27.32,33.25 27.32,33.63 J2.SH1 27.32,33.25 | 39.26,31.98 39.51,31.98 IC2.C2 39.64,31.98 40.02,31.98 IC2.C3 | 39.26,31.98 39.26,32.36 IC2.B1 39.13,32.36 38.11,32.36 36.84,33.63 32.52,33.63 31.64,32.74
  Top 0.127: 39.26,31.98 IC2.C1 | 30.62,31.72 31.64,32.74 | 30.62,31.72 30.37,31.72 D4.2 30.62,31.72 | 27.32,33.25 31.13,33.25 31.64,32.74 | U$27.2 31.26,27.53 32.4,27.53 32.91,27.02 33.16,27.02 33.67,27.53 U$28.2 33.67,27.66 35.32,27.66 | 39,24.48 36.08,24.48 TP10.TP 35.95,24.61 35.45,25.12 35.45,27.66 | 43.32,27.66 42.56,26.9 42.56,26.39 42.81,26.14 42.81,23.72 42.69,23.6 42.56,23.6 | 42.56,23.6 40.02,23.6 39.13,24.48 | 30.62,31.72 31.26,31.09 31.26,27.66 U$27.2 | v30.87,1.75 30.87,1.37 U$30.2 | v24.65,4.93 24.52,4.8 24.52,4.04 SW3.1 | v34.56,3.15 35.32,3.91 SW2.1 | 31.76,17.75 32.14,18.14 U$43.2 32.14,18.26 31.13,19.28 30.87,19.28 U$43.4 | 31.76,17.75 30.87,16.86 30.87,16.1 U$44.2 30.75,15.98 30.75,15.72 30.24,15.21 | 31.76,17.75 32.65,16.86 32.65,16.1 U$45.2 | 30.24,15.21 26.6,11.57 C9.2 | 16.52,29.95 16.12,30.35 R11.2 15.99,30.48 15.3,31.17 15.3,33.7 | 16.52,29.95 16.9,29.56 18.55,29.56 J2.SH4 18.68,29.44 19.06,29.06 19.7,29.06 J2.A12_B1 19.82,28.93 19.82,26.14 21.86,24.1 | J2.SH2 18.55,33.63 17.8,34.48 R12.1 16.77,34.5 15.5,34.5 15.3,34.3 15.3,33.7 | 21.86,24.1 22.75,24.1 23.25,24.61 23.64,24.61 23.89,24.36 23.89,24.1 U$34.2 24.02,23.98 24.4,23.6 | 21.86,24.1 U$39.2 21.86,24.1 | 25.41,22.58 25.67,22.58 U$36.2 | 24.4,23.6 25.41,22.58 | 26.18,24.36 26.18,24.1 U$38.2 | 26.18,24.36 25.92,24.61 25.41,24.61 24.4,23.6 | 25.92,18.64 26.18,18.39 26.81,18.39 U$1.P$F23 26.94,18.39 27.06,18.26 27.83,18.26 28.33,17.75 28.33,17.12 30.24,15.21 | 22.62,19.66 22.62,19.02 22.36,18.77 | U$37.2 21.09,22.45 21.09,20.42 21.22,20.29 21.22,19.53 21.98,18.77 22.24,18.77 U$1.P$74 | 23.38,21.18 23.38,22.45 U$35.2
  Top 0.127: 23.38,21.18 22.49,20.29 22.49,19.79 22.62,19.66 | 22.62,19.66 U$1.P$B7 | 22.36,16.23 22.36,15.21 U$1.P$87 | 22.36,16.23 U$1.P$83 | 22.36,16.23 U$1.P$74 | U$1.P$79 22.36,17.5 23,18.14 U$1.P$74 | 22.36,18.77 U$1.P$75 | 22.36,18.77 U$1.P$74 | 23.51,16.23 23.51,15.21 U$1.P$88 | 23.51,16.23 U$1.P$84 | 23.51,16.23 U$1.P$74 | U$1.P$80 U$1.P$74 | U$1.P$89 24.78,15.21 24.78,16.23 U$1.P$74 | U$1.P$74 24.65,16.36 U$1.P$85 24.78,16.36 25.79,16.36 U$1.P$86 25.92,16.23 25.92,15.21 U$1.P$90 | U$1.P$81 24.78,17.5 U$1.P$74 | U$1.P$76 23.38,18.64 22.87,18.14 U$1.P$74 | U$1.P$77 24.78,18.64 25.29,18.14 25.41,18.14 U$1.P$74 | U$1.P$82 25.79,17.5 25.29,18.01 U$1.P$74 | 25.92,18.64 U$1.P$78 | 25.92,18.64 U$1.P$74 | 25.41,22.58 24.02,21.18 23.38,21.18 | 26.18,24.36 26.68,24.87 28.59,24.87 31.13,27.41 31.13,27.53 U$27.2 | 16.52,29.95 16.52,29.82 | U$41.2 44.53,8.77 v44.3,9 | 15.3,33.7 14.7,33.7 IC4.B3 | U$22.1 13.15,23.45 v13.75,24.05 | U$51.1 U$50.1 | U$51.1 5.9,34.13 5.95,34.18 | U$48.2 U$51.1
  Route2 0.127: 30.87,4.93 30.87,8.81 25.9,13.78 U$1.P$90 | 30.87,4.93 v30.87,1.75 | 30.87,4.93 v24.65,4.93 | 30.87,3.4 32.78,3.4 33.03,3.15 v34.56,3.15 35.15,3.15 v37.14,5.14 | v43.4,6.2 43.4,7.2 44.3,8.1 v44.3,9
  Bottom 0.127: v13.75,24.05 13.75,24.62 J2.SH4
IMU_INT1
  Top 0.127: U$1.P$N1 20.74,16.54 18.2,16.54 16.98,17.75 15.89,17.75 14.11,15.98 14.11,8.86 8.01,2.77 IC3.5
IMU_INT2  (via drill 0.35)
  Top 0.127: U$1.P$P2 20.65,15.7 v19.4,15.7 | v10.1,5.6 10.1,5.28 8.18,3.35 IC3.6
  Bottom 0.127: v19.4,15.7 19.1,15.4 19.1,15 10.1,6 v10.1,5.6
LX1
  Top 0.127: 40.02,32.36 39.64,32.36 IC2.B2 | 40.02,32.36 41.29,32.36 42.3,31.34 43.32,31.34 43.57,31.09 43.57,29.95 42.56,28.93 42.3,28.93 41.92,28.55 41.92,24.99 L1.1 | 40.02,32.36 IC2.B3
LX2  (via drill 0.3)
  Top 0.127: 40.02,31.6 39.64,31.6 IC2.D2 | 40.02,31.6 40.27,31.6 v41.29,30.58 | v43.07,26.77 43.07,25.88 43.95,24.99 L1.2 | 40.02,31.6 IC2.D3
  Bottom 0.127: v41.29,30.58 41.29,30.2 43.07,28.42 v43.07,26.77
N$1  (via drill 0.3)
  Top 0.127: v20.66,14.07 22.11,14.07 U$1.P$AC5 | v22.49,7.97 22.49,6.83 22.87,6.45 U$8.1
  Bottom 0.127: v20.66,14.07 20.66,13.49 22.49,11.66 v22.49,7.97
N$2
  Top 0.127: R12.2 17.07,32.87 18.05,32.87 19.7,31.22 22.62,31.22 24.14,29.69 24.14,29.06 J2.A5
N$4  (via drill 0.3, 0.35)
  Top 0.127: v43.32,8.23 43.32,8.86 43.19,8.99 U$12.2 42.96,9.15 42.84,9.5 v40.5,9.5 | Q1.3 33.67,8.86 36.26,8.86 38.09,10.7 D3.2 38.4,9.45 v38.4,9.4 | v43.95,4.56 43.95,4.46 U$11.2
  Bottom 0.127: v43.95,4.56 43.95,7.59 v43.32,8.23 | v40.5,9.5 38.5,9.5 v38.4,9.4
N$5
  Top 0.127: IC2.D1 39.13,31.6 37.61,31.6 36.46,30.45 R3.1
N$6
  Top 0.127: IC3.1 6.36,2.39 6.24,2.39 5.09,3.53 5.09,7.47 3.44,9.12 R6.1
N$7
  Top 0.127: IC1.D1 13.22,28.93 13.22,30.07 9.92,33.38 9.16,33.38 8.9,33.63 7.7,33.63 7.29,33.22 7.29,31.64 6.65,31 4.35,31 R1.2
N$8
  Top 0.127: IC2.E1 39.26,31.22 39.26,31.09 40.27,30.07 42.3,30.07 42.69,30.45 R2.1
N$9  (via drill 0.3)
  Top 0.127: v18.81,18.39 19.19,18.77 20.97,18.77 21.09,18.9 U$1.P$D2 | v14.87,13.82 14.87,6.45 16.9,4.42 | 16.9,4.42 17.67,3.66 U$4.2 | 16.9,4.42 15.63,3.15 15.13,3.15 14.87,3.4 14.87,3.78 15.13,4.04 15.38,4.04 U$3.2
  Bottom 0.127: v14.87,13.82 13.72,14.97 13.72,19.57 15.49,21.34 17.21,21.34 18.81,19.74 v18.81,18.39
N$10  (via drill 0.3)
  Top 0.127: v27.45,19.15 27.45,18.64 U$1.P$E24 | v23.89,21.69 23.89,22.45 U$35.1 23.89,22.58 23.89,23.47 23.38,23.98 | 22.11,23.09 U$1.P$B5 | 22.11,23.09 21.22,23.98 U$39.1 21.09,24.1 19.32,24.1 U$33.2 | 23.38,23.98 23,23.98 22.11,23.09 | 23.38,23.98 U$34.1
  Route2 0.127: v27.45,19.15 26.43,19.15 v23.89,21.69
N$11  (via drill 0.3)
  Top 0.127: v21.6,21.06 U$1.P$B3 | v27.32,22.96 27.83,22.96 28.08,23.21 U$32.1
  Bottom 0.127: v21.6,21.06 25.41,21.06 v27.32,22.96
N$12
  Top 0.127: 41.41,8.99 39.38,8.99 37.1,6.71 D2.1 | 41.41,8.99 42.56,8.99 U$12.1 | 41.41,8.99 41.41,3.02 D1.2
N$13  (via drill 0.3)
  Top 0.127: v20.08,23.21 19.32,23.21 U$33.1 | v26.81,24.23 28.08,24.23 U$32.2
  Bottom 0.127: v20.08,23.21 25.79,23.21 v26.81,24.23
N$14
  Top 0.127: R11.1 20.08,30.96 21.22,29.82 21.22,29.06 J2.B5
N$15  (via drill 0.3)
  Top 0.127: SJ1.2 28.71,5.18 28.71,5.44 30.37,7.09 30.37,7.59 R7.1 30.49,7.72 v35.95,7.72 | v44.84,8.23 44.84,7.34 R8.2
  Bottom 0.127: v44.84,8.23 43.95,8.23 43.45,8.74 43.07,8.74 42.05,7.72 v35.95,7.72
N$16
  Top 0.127: U$1.P$A18 25.29,20.17 25.29,21.31 26.18,22.2 26.18,22.45 U$36.1
N$17  (via drill 0.3)
  Top 0.127: v27.19,20.55 27.19,20.42 26.94,20.17 U$1.P$A23 | v28.21,20.55 31,20.55 32.14,19.41 U$43.3 | v32.14,16.61 32.14,16.1 U$45.1
  Bottom 0.127: v27.19,20.55 v28.21,20.55 v32.14,16.61
N$18
  Top 0.127: U$1.P$D23 26.94,18.9 26.94,19.66 27.7,20.42 27.7,21.95 25.67,23.98 U$38.1
N$19
  Top 0.127: IC4.A2 13.09,33.12 11.7,34.52 10.17,34.52 10.05,34.39 10.05,34.14 U$26.1
N$20  (via drill 0.3)
  Top 0.127: v19.44,19.28 19.57,19.15 U$1.P$C1 | U$5.2 23.62,10.61 v23.62,9.77
  Route2 0.127: v19.44,19.28 19.44,18.64 21.25,16.84 21.25,13.1 21,12.85 21,11.59 22.82,9.77 v23.62,9.77
N$21  (via drill 0.3)
  Top 0.127: v19.44,17.75 20.21,18.52 20.97,18.52 21.09,18.39 U$1.P$F2 | v19.44,6.83 19.44,4.42 19.57,4.29 | 19.57,4.29 19.7,4.16 U$2.2 | v17.79,2.01 17.79,1.24 U$4.1 | v19.06,3.28 19.06,3.78 19.57,4.29
  Route2 0.127: v19.44,17.75 19.44,16.5 20.07,15.88 20.07,14.32 19.44,13.69 v19.44,6.83
  Bottom 0.127: v19.06,3.28 v17.79,2.01
N$22  (via drill 0.3)
  Top 0.127: v27.83,17.63 27.45,18.01 27.19,18.01 27.06,17.88 26.94,17.88 U$1.P$H23 | U$42.1 29.6,10.88 v29.5,11.02 | v32.27,7.21 32.91,7.21 U$46.1
  Bottom 0.127: v27.83,17.63 27.83,17.27 29.5,15.6 v29.5,11.02 32.27,8.25 v32.27,7.21
N$26
  Top 0.127: U$15.2 12.59,19.41 12.59,18.77 11.44,17.63 11.44,15.21 11.06,14.83 10.68,14.83 J1.18
N$27
  Top 0.127: U$16.2 12.59,13.05 11.44,14.2 10.68,14.2 J1.19
N$28
  Top 0.127: U$17.2 12.59,11.79 12.59,12.42 11.95,13.05 11.95,13.31 11.57,13.69 10.68,13.69 J1.20
N$30
  Top 0.127: U$19.2 12.71,20.68 12.71,20.42 13.22,19.91 13.35,19.91 13.86,19.41 13.86,11.13 13.75,11.02 10.55,11.02 10.05,11.53 10.05,12.55 10.17,12.67 10.55,12.67 J1.22
N$31
  Top 0.127: 30.75,18.14 29.22,19.66 27.45,19.66 U$1.P$B24 | 30.75,18.14 30.37,17.75 30.37,16.1 U$44.1 | 30.75,18.14 U$43.1
N$32
  Top 0.127: U$21.2 12.71,14.2 12.71,14.07 13.6,13.18 13.6,11.4 13.47,11.28 11.06,11.28 10.68,11.66 J1.24
N$33
  Top 0.127: U$22.2 12.59,23.21 12.59,22.96 11.44,21.82 10.68,21.82 J1.4
N$34
  Top 0.127: U$23.2 12.59,21.95 11.95,21.95 11.32,21.31 10.68,21.31 J1.5
N$35
  Top 0.127: U$46.2 33.03,6.07 33.29,5.82 35.06,5.82 U$40.1 35.19,5.82 35.19,6.07 37.73,8.61 38.62,8.61 40.12,10.11 40.88,10.11 41.78,11.01 | 41.78,11.01 ANT1.1 | U$41.1 44.92,9.28 44.6,9.6 43.2,9.6 41.78,11.01
N$38
  Top 0.127: U$1.P$N24 27.45,16.61 29,15.06 29,14.36 25.67,11.02 C9.1
P0.13/1.5D  (via drill 0.3)
  Top 0.127: 14.11,6.07 12.33,6.07 10.68,4.42 10.68,4.04 SW1.2 | 14.11,6.07 14.36,6.07 R13.1 | v15.76,1.75 15.76,0.99 15.63,0.86 15.38,0.86 U$29.1 | v14.49,4.93 14.11,5.31 14.11,6.07
  Bottom 0.127: v15.76,1.75 15.76,3.66 v14.49,4.93
P0.14/1.5D
  Top 0.127: R14.1 36.59,4.16 35.95,4.8 34.94,4.8 34.81,4.93 33.29,4.93 32.65,4.29 32.65,4.04 SW2.2 32.52,3.91 32.02,3.91 30.37,2.26 30.37,1.24 30.75,0.86 30.87,0.86 U$30.1
P1.01/1.6C
  Top 0.127: R10.1 26.3,1.37 27.19,1.37 27.7,0.86 Q2.1
P1.02/1.6C
  Top 0.127: R15.1 25.67,4.16 25.67,4.55 24.78,5.44 22.75,5.44 21.6,4.29 21.6,4.04 SW3.2 21.48,3.91 21.09,3.91 20.21,3.02 20.21,1.12 19.95,0.86 19.82,0.86 U$31.1
PMIC_INT  (via drill 0.35)
  Top 0.127: U$1.P$T2 20.75,15.3 19.7,15.3 19.3,14.9 v18.5,15.7 | IC1.A1 13.21,26.96 12.72,26.48 15.9,23.3 15.9,22.1 | 15.9,22.1 15.95,22.05 | 15.9,22.1 15.9,21.45 14.3,19.85 14.3,17.75 v14.55,17.5
  Bottom 0.127: v18.5,15.7 18.5,17.2 18.2,17.5 v14.55,17.5
PREVGH  (via drill 0.3)
  Top 0.127: v12.59,17.5 12.59,18.14 U$18.2 | v11.44,13.18 10.68,13.18 J1.21 | v33.41,11.66 34.56,11.66 35.45,10.77 36.08,10.77 D3.1
  Route15 0.127: 33.21,11.46 33.28,11.52 | 33.28,11.52 v33.41,11.66 | v12.59,17.5 17.29,12.8 22.77,12.8 24.22,11.35 28.85,11.35 29.25,11.75 33.05,11.75 33.28,11.52
  Bottom 0.127: v12.59,17.5 12.59,15.6 11.44,14.45 v11.44,13.18
PREVGL  (via drill 0.3, 0.35)
  Top 0.127: v12.59,14.96 12.59,15.47 U$20.2 | v11.44,12.29 10.68,12.29 J1.23 | v35.7,5.94 37.61,5.94 38.24,6.58 40.53,6.58 D2.2
  Route2 0.127: v11.44,12.29 18.07,5.66 24.56,5.66 v25.2,6.3
  Bottom 0.127: v12.59,14.96 12.59,13.44 v11.44,12.29 | v35.7,5.94 27.26,5.94 26.9,6.3 v25.2,6.3
RESE  (via drill 0.3)
  Top 0.127: v9.92,22.2 10.55,22.2 J1.3 | v27.32,8.99 28.59,7.72 R7.2 28.71,7.72 29.1,7.72 32.14,10.77 32.78,10.77 Q1.2
  Route2 0.127: v9.92,22.2 15.13,22.2 18.3,19.02 18.43,19.02 18.81,19.41 18.81,19.53 19.19,19.91 19.7,19.91 21.55,18.06 21.55,12.96 23.02,11.49 23.32,11.49 25.82,8.99 v27.32,8.99
RESET  (via drill 0.3, 0.35)
  Top 0.127: v32.91,23.72 33.29,23.34 38.88,23.34 41.41,20.8 41.41,19.66 40.53,18.77 40.53,18.39 J3.6 | v18.3,13.36 17.67,12.73 | 17.67,12.73 16.74,11.8 TP8.TP | U$1.P$AC13 24.45,13.8 24.7,13.8 24.9,13.6 v24.9,13.05 | v18.5,11.9 17.67,12.73
  Bottom 0.127: v32.91,23.72 26.68,23.72 25.16,22.2 22.11,22.2 19.95,20.04 19.95,15.01 v18.3,13.36 | v24.9,13.05 24.9,11.3 24.75,11.15 21.3,14.6 20.6,14.6 19,13 19,12.4 v18.5,11.9
SCL/1.4C  (via drill 0.3)
  Top 0.127: v10.73,33.19 11.82,32.11 12.59,32.11 IC4.C1 | v9.16,31.47 10.36,30.27 10.36,29.24 8.78,27.66 8.39,27.66 U1.7
  Bottom 0.127: v10.73,33.19 10.73,33.05 v9.16,31.47
SCL/2.4C  (via drill 0.3)
  Top 0.127: v13.73,27.66 13.22,28.17 IC1.B1 | v13.73,26.39 14.78,25.34 14.78,24.85 v17.29,22.33 14.73,19.77 TP4.TP 16.15,19.05 18.3,16.9 U$1.P$M2 | v5.98,8.1 5.98,3.15 6.24,2.89 6.36,2.89 IC3.12 | v4.46,6.58 3.82,6.58 R4.2 | v34.81,30.84 36.08,32.11 36.34,32.11 R3.2
  Bottom 0.127: v13.73,26.39 13.73,26.64 | 13.73,26.64 v13.73,27.66 | 13.73,26.64 9.16,22.07 9.16,11.53 5.98,8.36 v5.98,8.1 v4.46,6.58 | v34.81,30.84 25.79,30.84 v17.29,22.33
SDA/1.4C  (via drill 0.35)
  Top 0.127: U1.8 9.7,29.37 v9.7,29.9 | v14.5,30.5 14.5,31.7 14.3,31.9 13.8,31.9 IC4.B2
  Bottom 0.127: v9.7,29.9 10.3,30.5 v14.5,30.5
SDA/2.4C  (via drill 0.3)
  Top 0.127: v7,2.89 7,2.39 IC3.2 | v4.59,3.91 4.2,3.91 3.7,3.4 R5.2 | U$1.P$L1 20.7,17.3 20.14,17.25 19.32,17.25 17.79,18.77 17.79,24.1 16.65,25.25 TP3.TP 16.52,25.37 14.87,27.02 v14.87,27.41 | v13.73,28.55 IC1.C1 | v41.92,32.36 42.05,32.23 42.69,32.23 R2.2
  Bottom 0.127: v7,2.89 5.6,2.89 v4.59,3.91 4.59,6.07 9.41,10.9 9.41,21.06 14.87,26.52 v14.87,27.41 | v14.87,27.41 v13.73,28.55 | v41.92,32.36 28.59,32.36 27.83,31.6 19.06,31.6 v14.87,27.41
SWDCLK
  Top 0.127: 33.41,21.82 33.41,22.58 31.51,24.48 TP7.TP | 33.41,21.82 33.41,13.56 31.76,11.91 29.35,11.91 27.83,10.39 25.29,10.39 25.03,10.64 25.03,11.4 25.29,11.66 25.41,11.66 27.2,13.45 27.2,13.8 27,14 27,14.3 U$1.P$AA24 | 33.41,21.82 37.22,21.82 38.24,20.8 38.24,19.66 39.13,18.77 39.13,18.39 J3.4
SWDIO  (via drill 0.3, 0.35)
  Top 0.127: v35.95,18.52 36.97,18.52 37.1,18.39 37.86,18.39 J3.2 | v32.91,15.09 32.91,14.83 31.38,13.31 TP6.TP 31,13.2 30.1,12.3 v28.8,12.3 | U$1.P$AC24 27.75,14.55 v28.35,14.55
  Bottom 0.127: v35.95,18.52 35.95,18.14 v32.91,15.09 | v28.8,12.3 28.35,12.75 v28.35,14.55
SWO
  Top 0.127: U$1.P$AD22 26.3,13.56 25.41,12.67 24.95,12.45 24.5,12.6 19.9,12.6 TP5.TP
VBAT/1.2A
  Top 0.127: 5.73,27.91 5.73,28.17 6.87,29.31 6.87,30.2 U$14.1 | 5.73,27.91 5.98,27.66 6.36,27.66 U1.2 6.49,27.53 6.49,27.15 U1.3 | 5.73,27.91 3.44,27.91 2.43,26.9 TP2.TP
VBAT/2.5C
  Top 0.127: IC1.C2 12.84,28.55 12.71,28.55 8.51,32.75 U$49.1
VBUS/1.5D  (via drill 0.3)
  Top 0.127: 33.16,28.04 33.16,29.82 33.67,30.33 33.67,31.22 33.29,31.6 32.91,31.6 D4.5 | 33.16,28.04 33.16,27.66 U$28.1 | 25.41,27.02 22.11,27.02 20.71,28.42 20.71,28.93 J2.A9_B4 | 25.41,27.02 27.19,27.02 27.7,27.53 30.62,27.53 U$27.1 | v25.41,28.04 25.41,28.93 J2.A4_B9 | 25.41,27.02 v25.41,26.77 | v32.65,28.04 33.16,28.04
  Bottom 0.127: v25.41,26.77 v25.41,28.04 v32.65,28.04
VBUS/2.6D  (via drill 0.3)
  Top 0.127: v20.08,13.44 20.21,13.56 21.35,13.56 U$1.P$AD2 | v21.65,11.71 21.65,9.83 22.87,8.61 U$9.1 | v10.59,27.79 12.84,27.79 IC1.A2 | U$47.1 3.84,32.13 v3.82,32.11
  Route15 0.127: v20.08,13.44 20.08,16.23 10.59,25.72 v10.59,27.79
  Bottom 0.127: v21.65,11.71 20.08,11.94 v20.08,13.44 | v10.59,27.79 8.14,27.79 v3.82,32.11
VREG  (via drill 0.3)
  Top 0.127: v10.68,28.93 11.44,28.17 12.84,28.17 IC1.B2 | IC2.A3 40.02,32.87 39.64,32.87 IC2.A2 39.51,32.74 39.26,32.74 IC2.A1 39.13,32.87 v38.62,32.87 | v36.72,33.12 36.84,33.12 37.1,32.87 37.1,31.47 36.97,31.34 35.83,31.34 35.7,31.22 35.7,28.42 36.34,27.79 | v6.45,31.62 5.9,32.16 5.9,32.7 | 5.9,32.7 U$51.2 | 5.8,32.8 5.9,32.7 | U$51.2 U$48.1 | U$50.2 U$51.2
  Bottom 0.127: v10.68,28.93 9.28,28.93 8.27,29.95 | v6.45,31.62 8.19,29.87 8.27,29.95 | v38.62,32.87 36.97,32.87 v36.72,33.12 36.22,32.62 28.42,32.62 27.72,31.92 17.12,31.92 14.92,34.12 12.44,34.12 8.27,29.95